# EAGLE design Conectores (EAGLE 6.5.0)

## Sheet 1 of 6
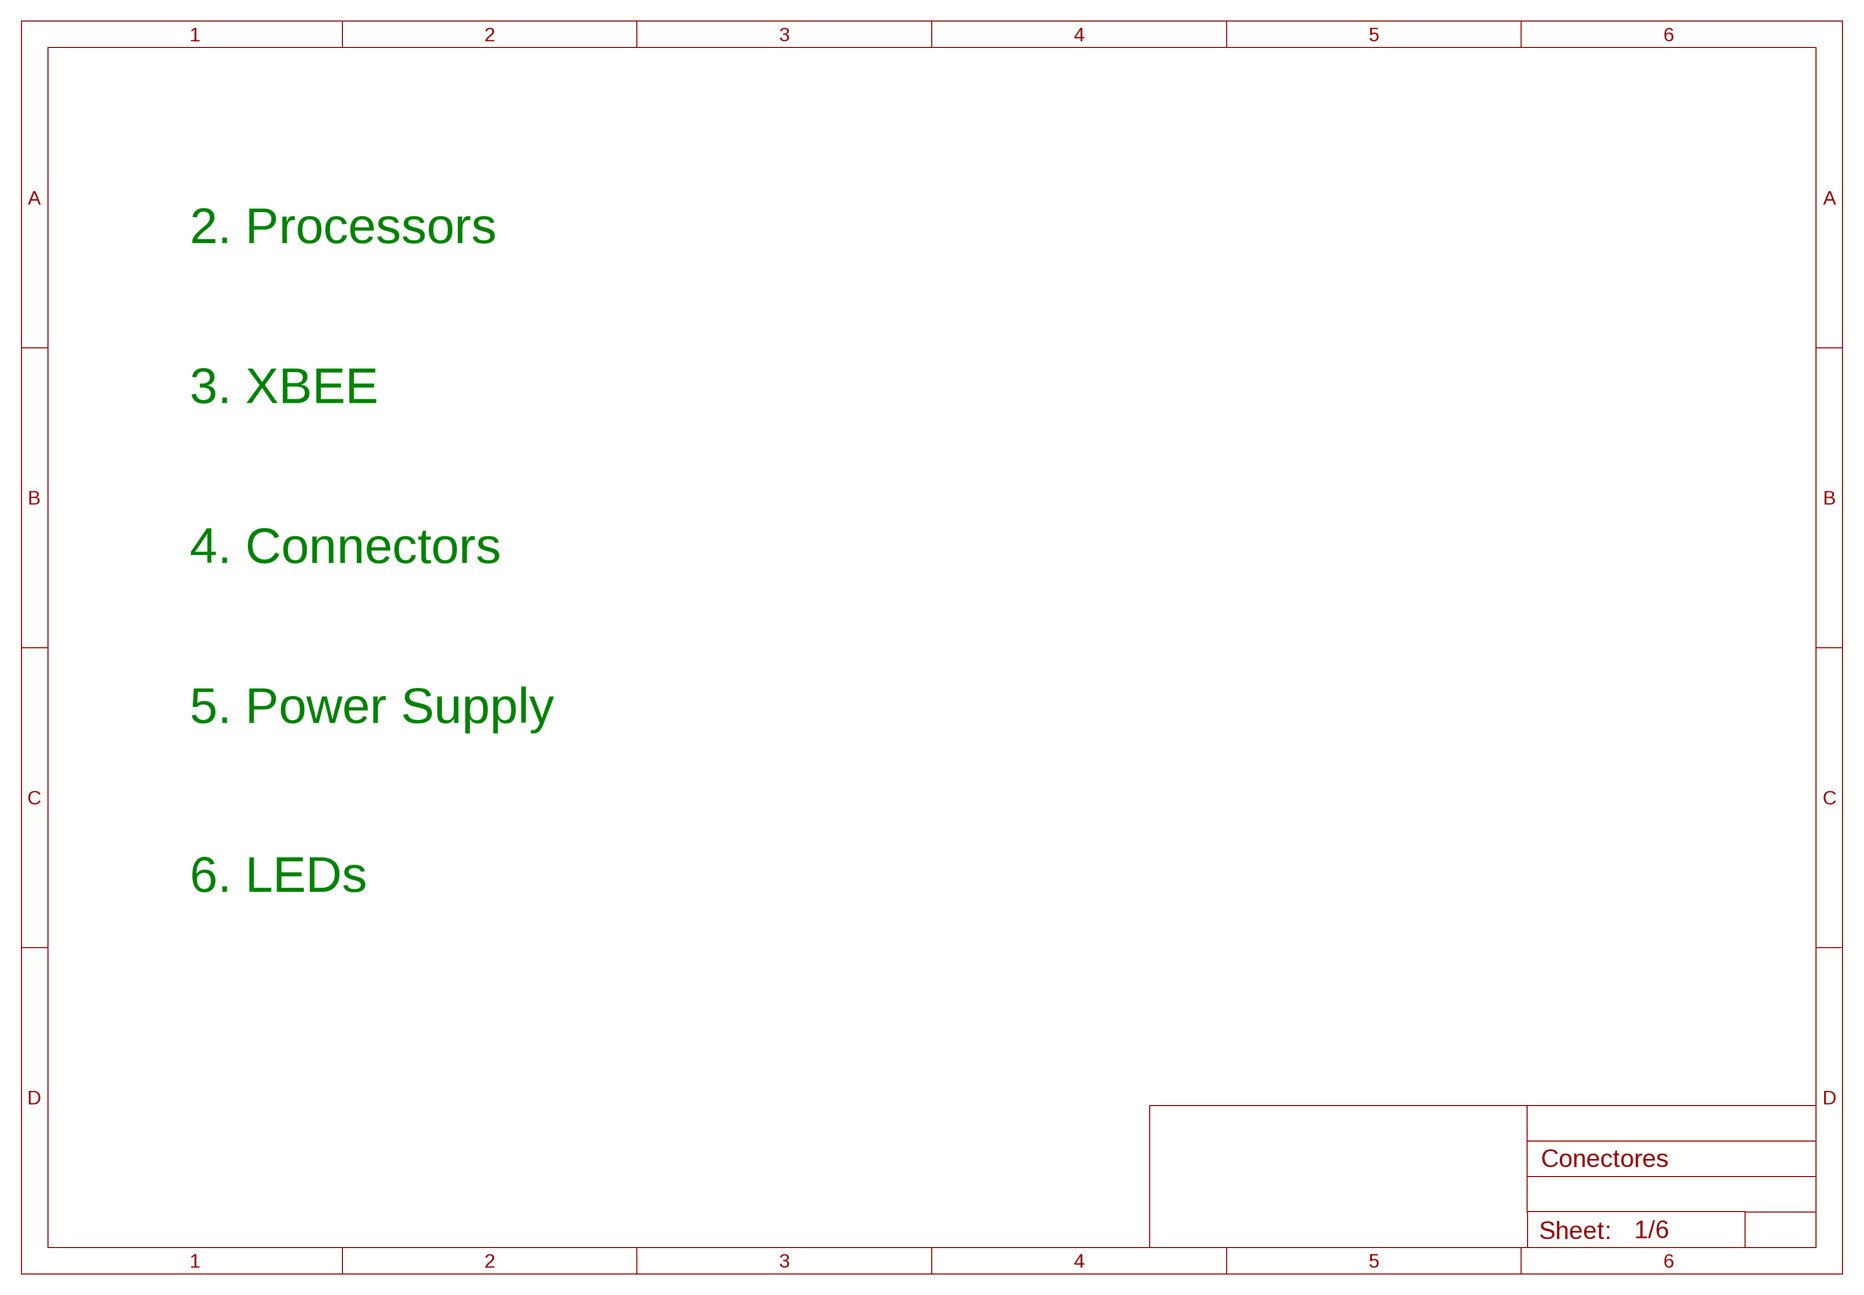
[diagram p0: schematic, sheet 1]

### Notes on the sheet
- 2. Processors
- 3. XBEE
- 4. Connectors
- 5. Power Supply
- 6. LEDs

## Sheet 2 of 6
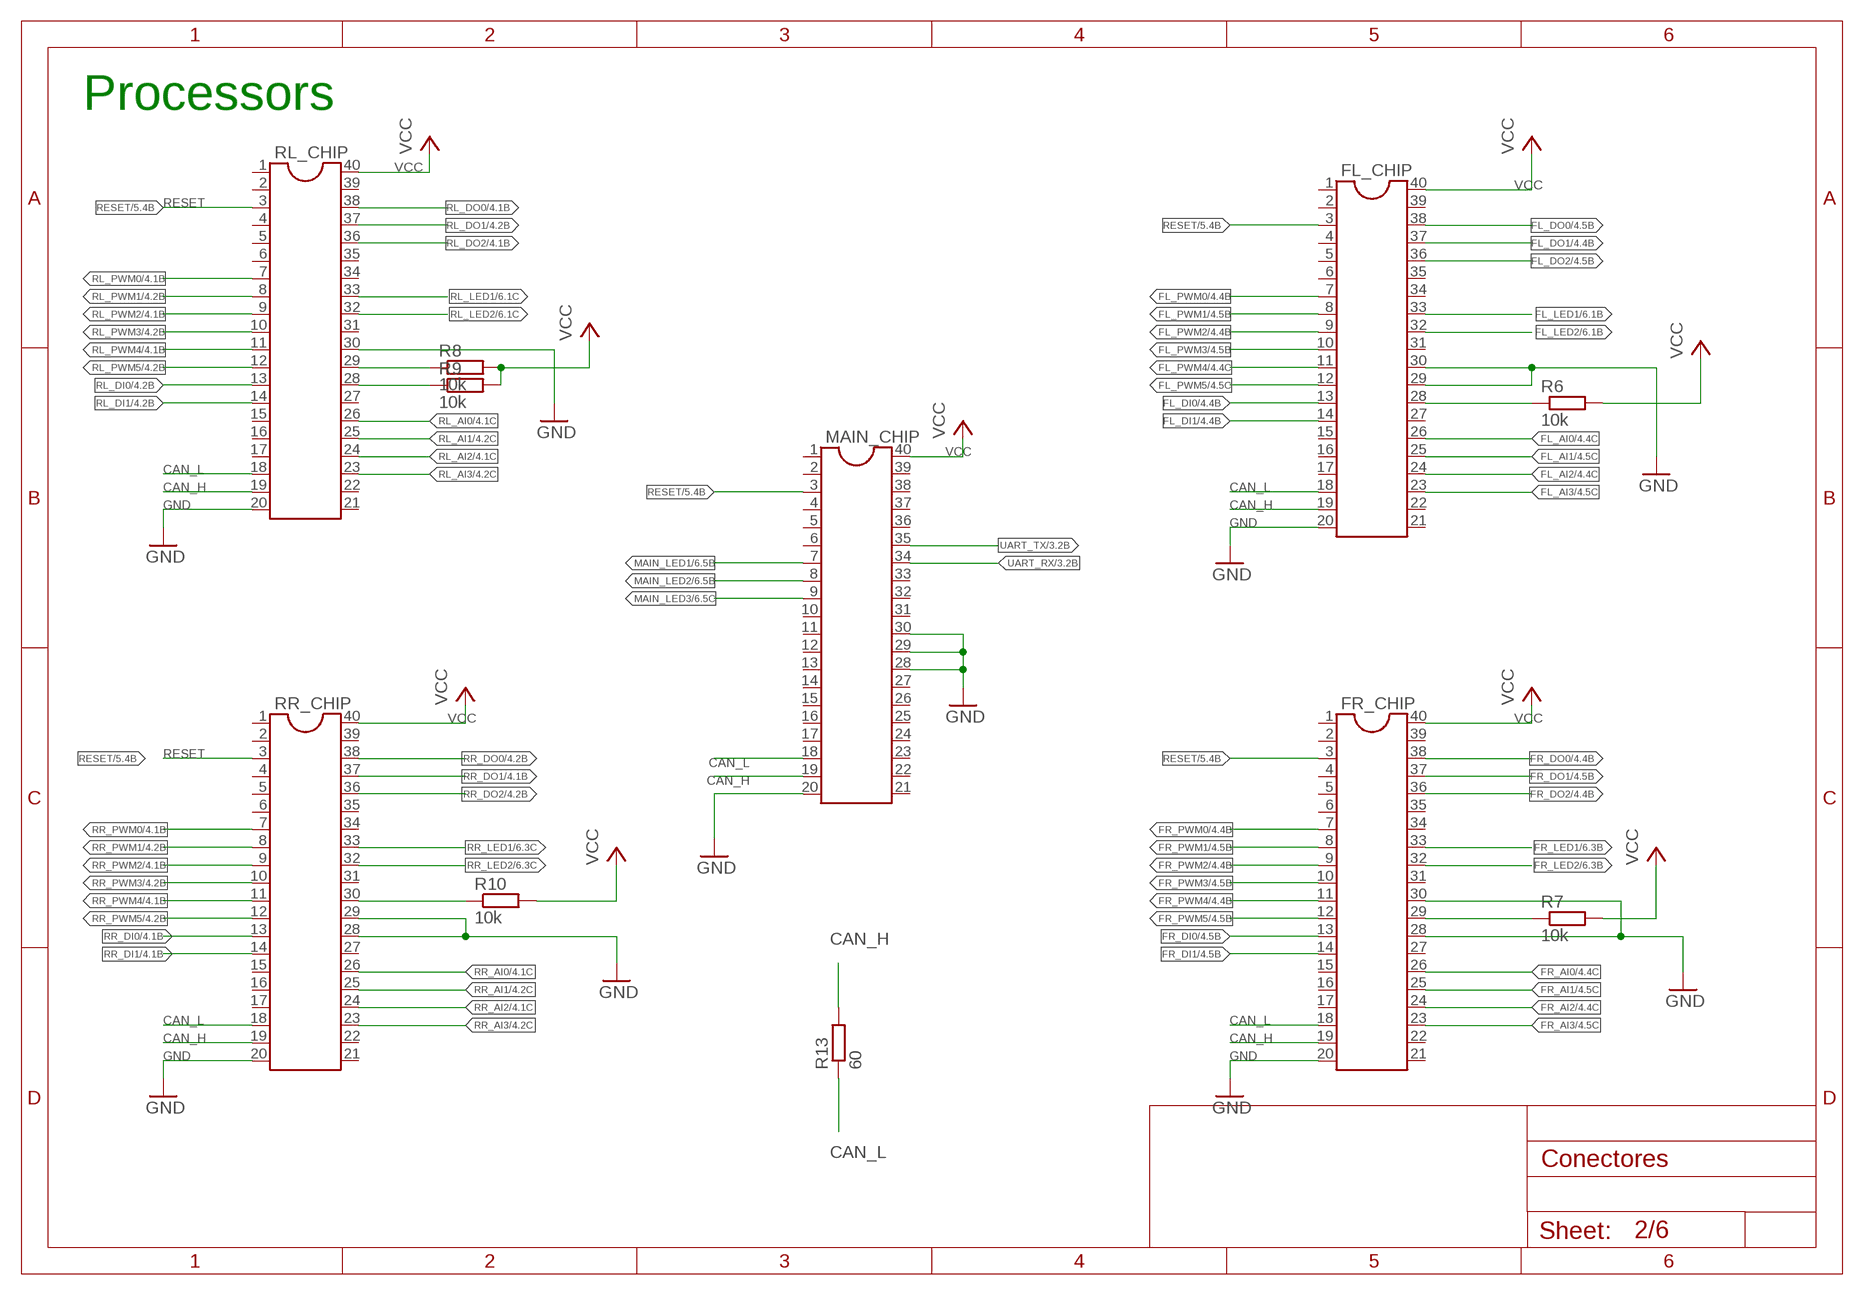
[diagram p1: schematic, sheet 2]

### Parts
FL_CHIP  DIL40  [DIL40]
FR_CHIP  DIL40  [DIL40]
MAIN_CHIP  DIL40  [DIL40]
R6  10k  R-EU_M0805  [M0805]
R7  10k  R-EU_M0805  [M0805]
R8  10k  R-EU_M0805  [M0805]
R9  10k  R-EU_M0805  [M0805]
R10  10k  R-EU_M0805  [M0805]
R13  60  R-EU_R0805  [R0805]
RL_CHIP  DIL40  [DIL40]
RR_CHIP  DIL40  [DIL40]

### Nets
CAN_H: FL_CHIP.19 FR_CHIP.19 MAIN_CHIP.19 R13.2 RL_CHIP.19 RR_CHIP.19 ; also sheet 4
CAN_L: FL_CHIP.18 FR_CHIP.18 MAIN_CHIP.18 R13.1 RL_CHIP.18 RR_CHIP.18 ; also sheet 4
FL_AI0: FL_CHIP.26 ; also sheet 4
FL_AI1: FL_CHIP.25 ; also sheet 4
FL_AI2: FL_CHIP.24 ; also sheet 4
FL_AI3: FL_CHIP.23 ; also sheet 4
FL_DI0: FL_CHIP.13 ; also sheet 4
FL_DI1: FL_CHIP.14 ; also sheet 4
FL_DO0: FL_CHIP.38 ; also sheet 4
FL_DO1: FL_CHIP.37 ; also sheet 4
FL_DO2: FL_CHIP.36 ; also sheet 4
FL_LED1: FL_CHIP.33 ; also sheet 6
FL_LED2: FL_CHIP.32 ; also sheet 6
FL_PWM0: FL_CHIP.7 ; also sheet 4
FL_PWM1: FL_CHIP.8 ; also sheet 4
FL_PWM2: FL_CHIP.9 ; also sheet 4
FL_PWM3: FL_CHIP.10 ; also sheet 4
FL_PWM4: FL_CHIP.11 ; also sheet 4
FL_PWM5: FL_CHIP.12 ; also sheet 4
FR_AI0: FR_CHIP.26 ; also sheet 4
FR_AI1: FR_CHIP.25 ; also sheet 4
FR_AI2: FR_CHIP.24 ; also sheet 4
FR_AI3: FR_CHIP.23 ; also sheet 4
FR_DI0: FR_CHIP.13 ; also sheet 4
FR_DI1: FR_CHIP.14 ; also sheet 4
FR_DIP2: FR_CHIP.29 R7.1
FR_DO0: FR_CHIP.38 ; also sheet 4
FR_DO1: FR_CHIP.37 ; also sheet 4
FR_DO2: FR_CHIP.36 ; also sheet 4
FR_LED1: FR_CHIP.33 ; also sheet 6
FR_LED2: FR_CHIP.32 ; also sheet 6
FR_PWM0: FR_CHIP.7 ; also sheet 4
FR_PWM1: FR_CHIP.8 ; also sheet 4
FR_PWM2: FR_CHIP.9 ; also sheet 4
FR_PWM3: FR_CHIP.10 ; also sheet 4
FR_PWM4: FR_CHIP.11 ; also sheet 4
FR_PWM5: FR_CHIP.12 ; also sheet 4
GND: FL_CHIP.20 FL_CHIP.29 FL_CHIP.30 FR_CHIP.20 FR_CHIP.28 FR_CHIP.30 MAIN_CHIP.20 MAIN_CHIP.28 MAIN_CHIP.29 MAIN_CHIP.30 RL_CHIP.20 RL_CHIP.30 RR_CHIP.20 RR_CHIP.28 RR_CHIP.29 ; also sheet 3,4,5,6
MAIN_LED1: MAIN_CHIP.7 ; also sheet 6
MAIN_LED2: MAIN_CHIP.8 ; also sheet 6
MAIN_LED3: MAIN_CHIP.9 ; also sheet 6
N$3: FL_CHIP.28 R6.1
RESET: FL_CHIP.3 FR_CHIP.3 MAIN_CHIP.3 RL_CHIP.3 RR_CHIP.3 ; also sheet 5
RL_AI0: RL_CHIP.26 ; also sheet 4
RL_AI1: RL_CHIP.25 ; also sheet 4
RL_AI2: RL_CHIP.24 ; also sheet 4
RL_AI3: RL_CHIP.23 ; also sheet 4
RL_DI0: RL_CHIP.13 ; also sheet 4
RL_DI1: RL_CHIP.14 ; also sheet 4
RL_DIP2: R8.1 RL_CHIP.29
RL_DIP3: R9.1 RL_CHIP.28
RL_DO0: RL_CHIP.38 ; also sheet 4
RL_DO1: RL_CHIP.37 ; also sheet 4
RL_DO2: RL_CHIP.36 ; also sheet 4
RL_LED1: RL_CHIP.33 ; also sheet 6
RL_LED2: RL_CHIP.32 ; also sheet 6
RL_PWM0: RL_CHIP.7 ; also sheet 4
RL_PWM1: RL_CHIP.8 ; also sheet 4
RL_PWM2: RL_CHIP.9 ; also sheet 4
RL_PWM3: RL_CHIP.10 ; also sheet 4
RL_PWM4: RL_CHIP.11 ; also sheet 4
RL_PWM5: RL_CHIP.12 ; also sheet 4
RR_AI0: RR_CHIP.26 ; also sheet 4
RR_AI1: RR_CHIP.25 ; also sheet 4
RR_AI2: RR_CHIP.24 ; also sheet 4
RR_AI3: RR_CHIP.23 ; also sheet 4
RR_DI0: RR_CHIP.13 ; also sheet 4
RR_DI1: RR_CHIP.14 ; also sheet 4
RR_DIP1: R10.1 RR_CHIP.30
RR_DO0: RR_CHIP.38 ; also sheet 4
RR_DO1: RR_CHIP.37 ; also sheet 4
RR_DO2: RR_CHIP.36 ; also sheet 4
RR_LED1: RR_CHIP.33 ; also sheet 6
RR_LED2: RR_CHIP.32 ; also sheet 6
RR_PWM0: RR_CHIP.7 ; also sheet 4
RR_PWM1: RR_CHIP.8 ; also sheet 4
RR_PWM2: RR_CHIP.9 ; also sheet 4
RR_PWM3: RR_CHIP.10 ; also sheet 4
RR_PWM4: RR_CHIP.11 ; also sheet 4
RR_PWM5: RR_CHIP.12 ; also sheet 4
UART_RX: MAIN_CHIP.34 ; also sheet 3
UART_TX: MAIN_CHIP.35 ; also sheet 3
VCC: FL_CHIP.40 FR_CHIP.40 MAIN_CHIP.40 R6.2 R7.2 R8.2 R9.2 R10.2 RL_CHIP.40 RR_CHIP.40 ; also sheet 5,6
Unconnected: FL_CHIP.1 FL_CHIP.2 FL_CHIP.4 FL_CHIP.5 FL_CHIP.6 FL_CHIP.15 FL_CHIP.16 FL_CHIP.17 FL_CHIP.21 FL_CHIP.22 FL_CHIP.27 FL_CHIP.31 FL_CHIP.34 FL_CHIP.35 FL_CHIP.39 FR_CHIP.1 FR_CHIP.2 FR_CHIP.4 FR_CHIP.5 FR_CHIP.6 FR_CHIP.15 FR_CHIP.16 FR_CHIP.17 FR_CHIP.21 FR_CHIP.22 FR_CHIP.27 FR_CHIP.31 FR_CHIP.34 FR_CHIP.35 FR_CHIP.39 MAIN_CHIP.1 MAIN_CHIP.2 MAIN_CHIP.4 MAIN_CHIP.5 MAIN_CHIP.6 MAIN_CHIP.10 MAIN_CHIP.11 MAIN_CHIP.12 MAIN_CHIP.13 MAIN_CHIP.14 MAIN_CHIP.15 MAIN_CHIP.16 MAIN_CHIP.17 MAIN_CHIP.21 MAIN_CHIP.22 MAIN_CHIP.23 MAIN_CHIP.24 MAIN_CHIP.25 MAIN_CHIP.26 MAIN_CHIP.27 MAIN_CHIP.31 MAIN_CHIP.32 MAIN_CHIP.33 MAIN_CHIP.36 MAIN_CHIP.37 MAIN_CHIP.38 MAIN_CHIP.39 RL_CHIP.1 RL_CHIP.2 RL_CHIP.4 RL_CHIP.5 RL_CHIP.6 RL_CHIP.15 RL_CHIP.16 RL_CHIP.17 RL_CHIP.21 RL_CHIP.22 RL_CHIP.27 RL_CHIP.31 RL_CHIP.34 RL_CHIP.35 RL_CHIP.39 RR_CHIP.1 RR_CHIP.2 RR_CHIP.4 RR_CHIP.5 RR_CHIP.6 RR_CHIP.15 RR_CHIP.16 RR_CHIP.17 RR_CHIP.21 RR_CHIP.22 RR_CHIP.27 RR_CHIP.31 RR_CHIP.34 RR_CHIP.35 RR_CHIP.39

### Notes on the sheet
- Processors

## Sheet 3 of 6
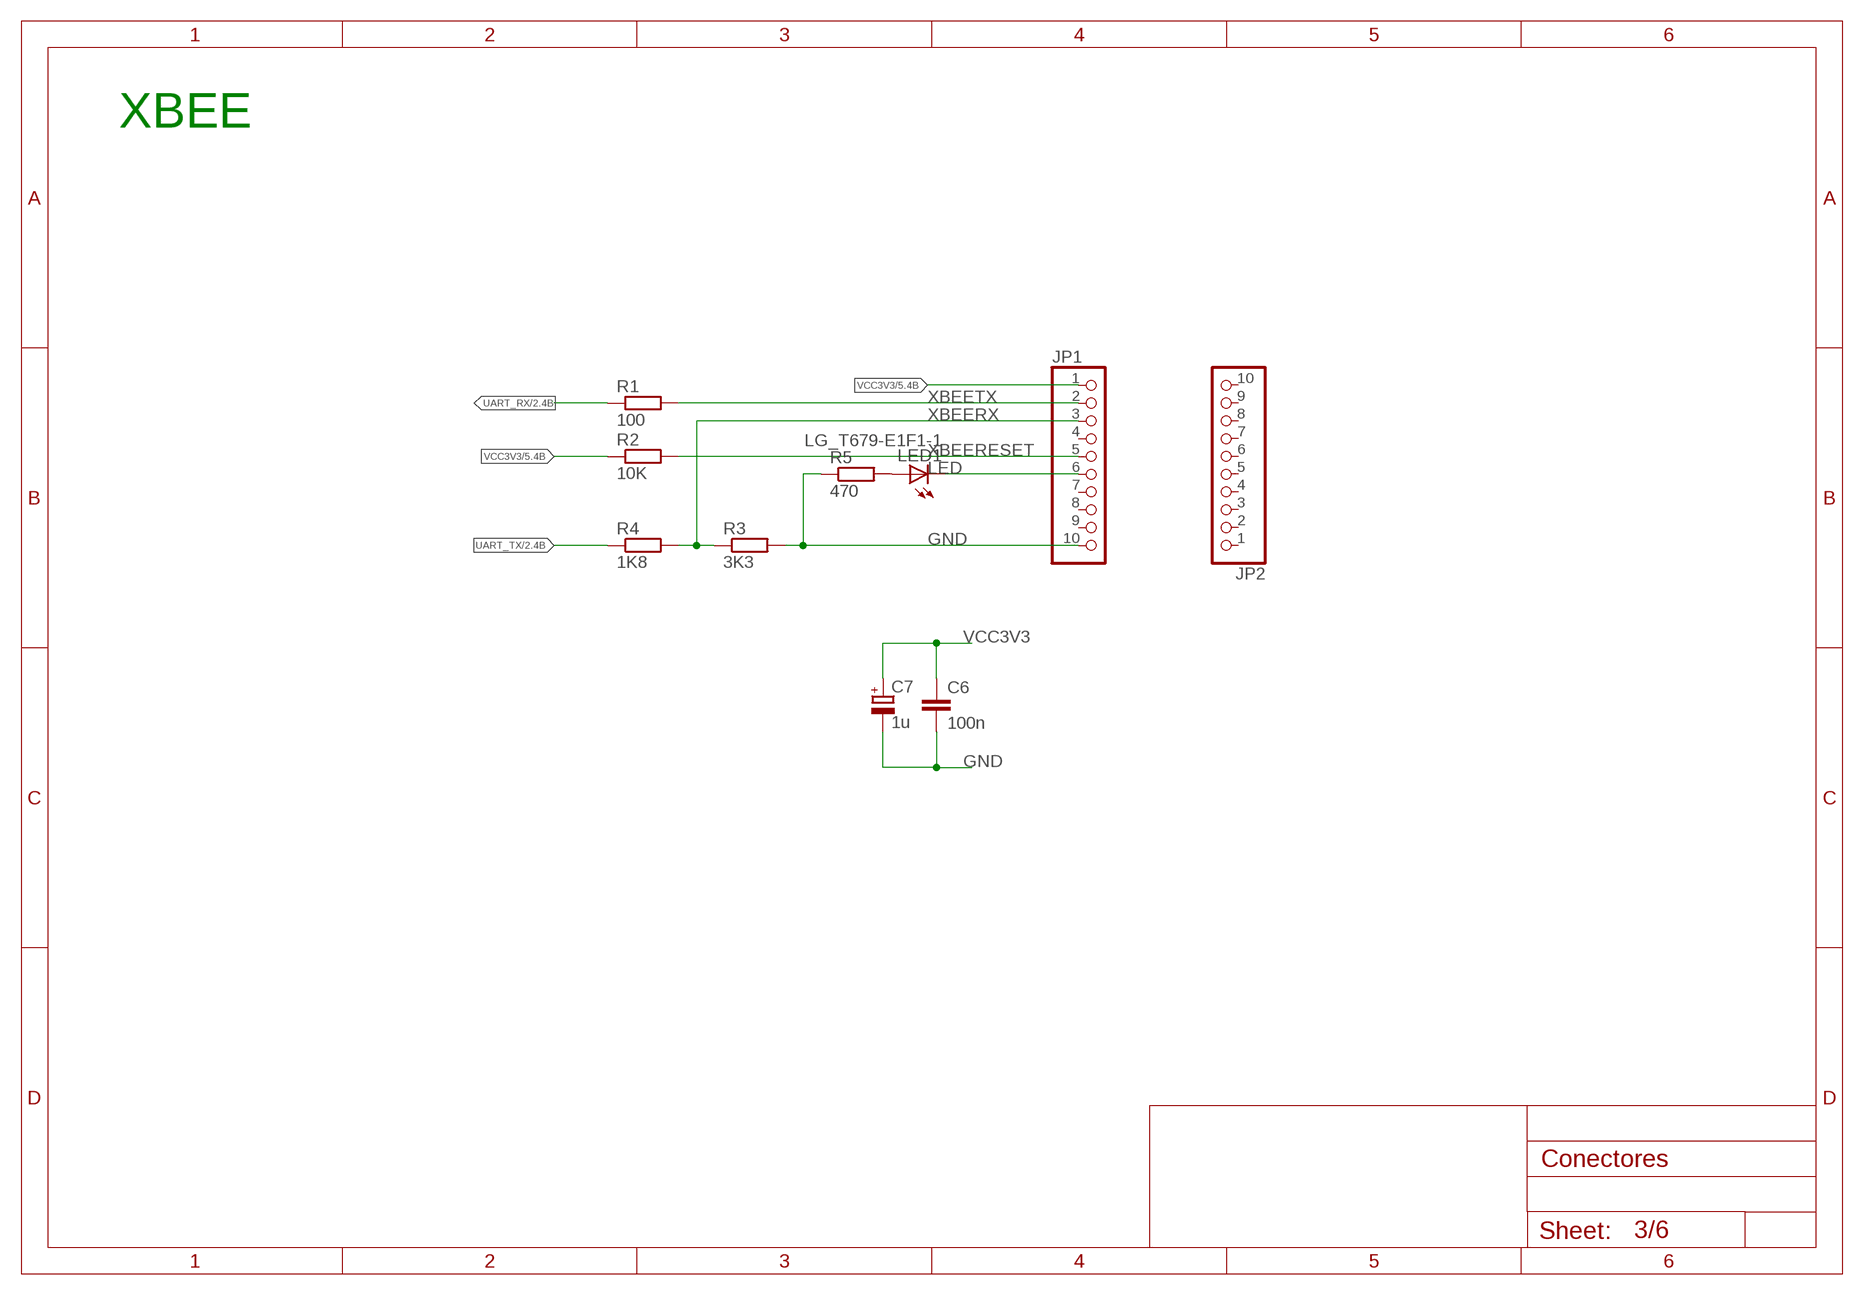
[diagram p2: schematic, sheet 3]

### Parts
C6  100n  C-EUC0805  [C0805]
C7  1u  CPOL-EUCT3528  [CT3528]
JP1  PINHD-1X10_2.00  [1X10M]
JP2  PINHD-1X10_2.00  [1X10M]
LED1  LG_T679-E1F1-1  [PLCC2]
R1  100  R-EU_M0805  [M0805]
R2  10K  R-EU_M0805  [M0805]
R3  3K3  R-EU_M0805  [M0805]
R4  1K8  R-EU_M0805  [M0805]
R5  470  R-EU_M0805  [M0805]

### Nets
GND: C6.2 C7.- JP1.10 R3.2 R5.1 ; also sheet 2,4,5,6
LED: JP1.6 LED1.C
N$1: LED1.A R5.2
UART_RX: R1.1 ; also sheet 2
UART_TX: R4.1 ; also sheet 2
VCC3V3: C6.1 C7.+ JP1.1 R2.1 ; also sheet 5
XBEERESET: JP1.5 R2.2
XBEERX: JP1.3 R3.1 R4.2
XBEETX: JP1.2 R1.2
Unconnected: JP1.4 JP1.7 JP1.8 JP1.9 JP2.1 JP2.2 JP2.3 JP2.4 JP2.5 JP2.6 JP2.7 JP2.8 JP2.9 JP2.10

### Notes on the sheet
- XBEE

## Sheet 4 of 6
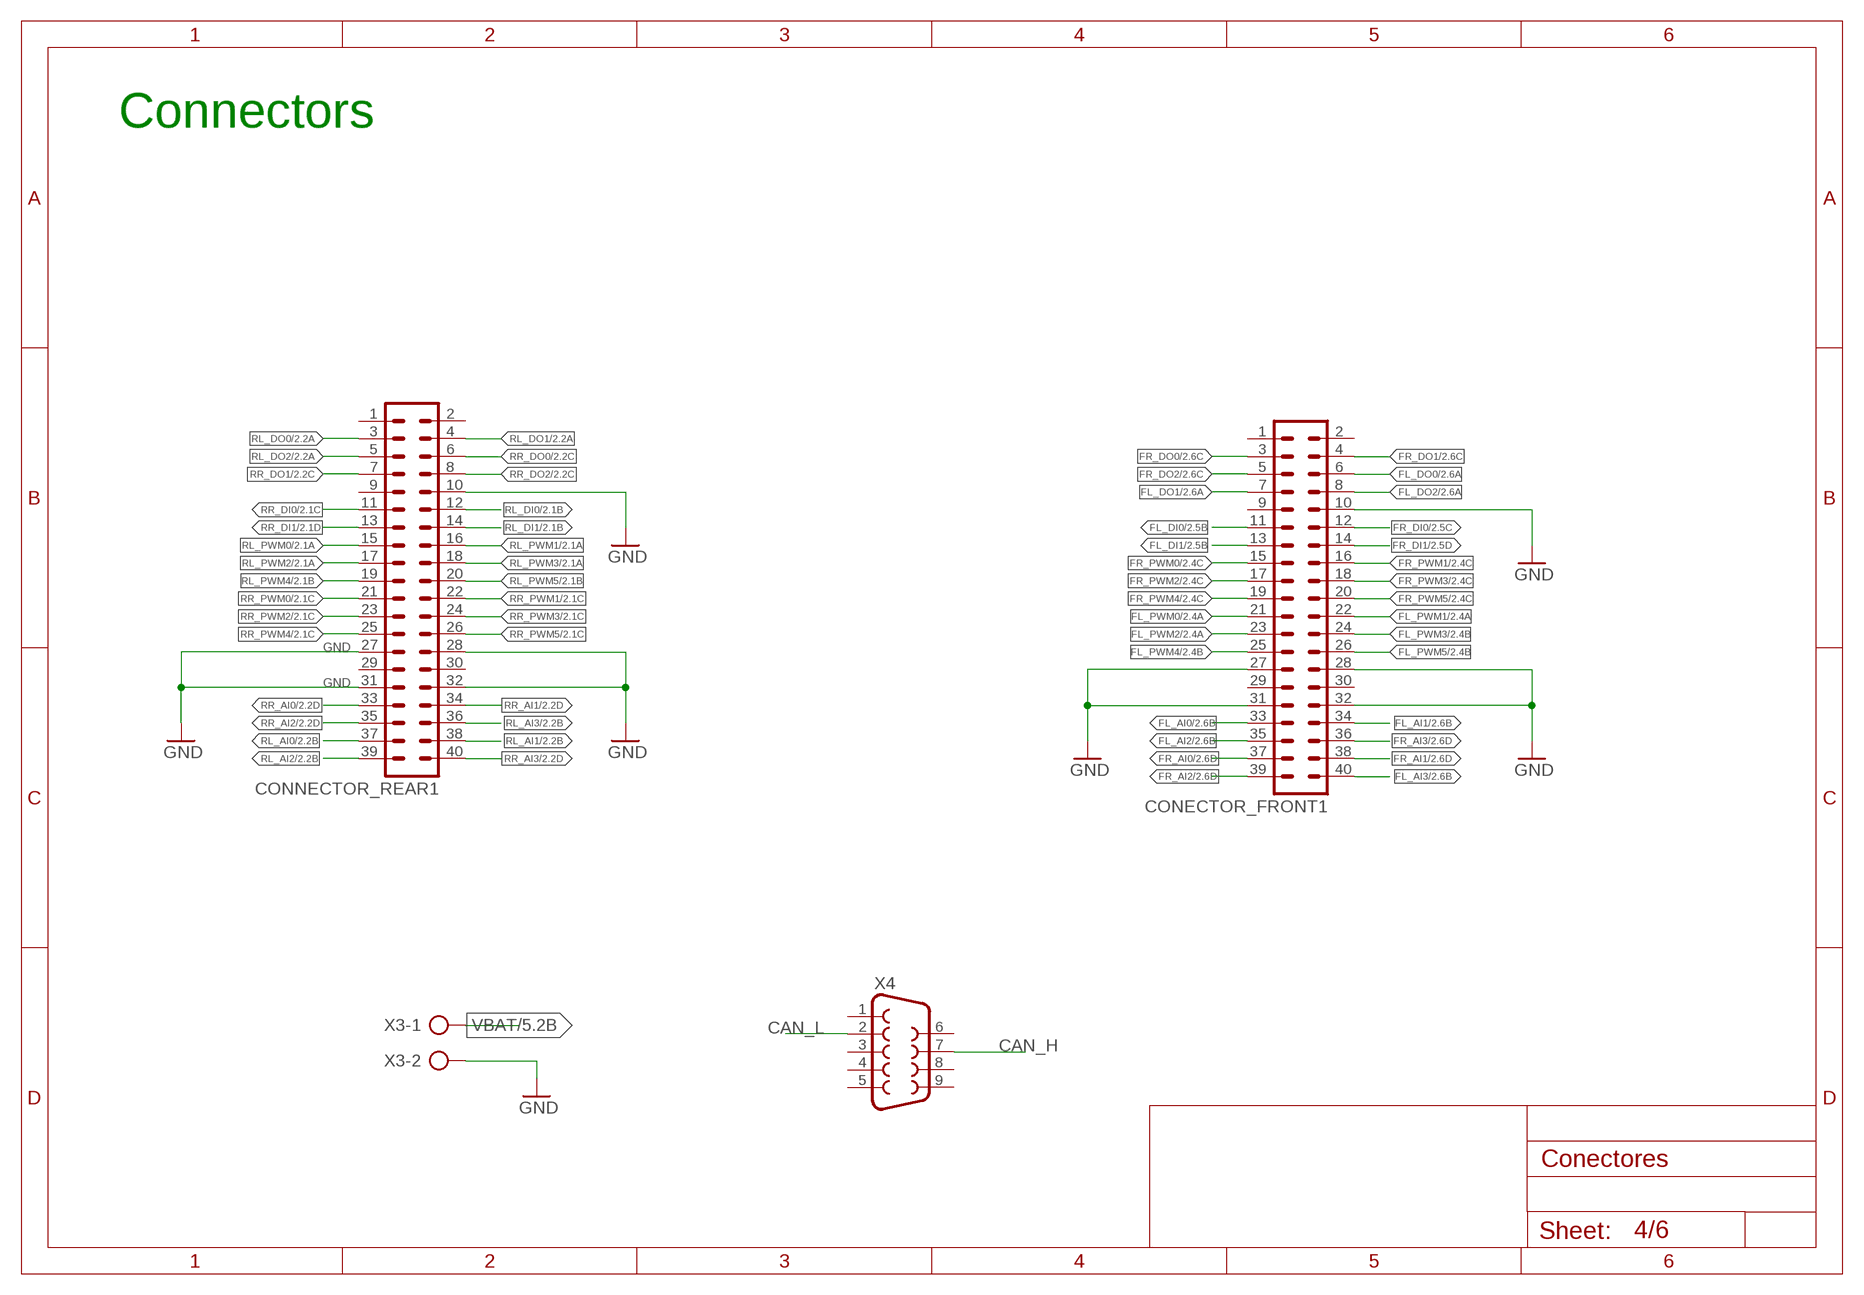
[diagram p3: schematic, sheet 4]

### Parts
CONECTOR_FRONT1  ML40  [ML40]
CONNECTOR_REAR1  ML40  [ML40]
X3  AK300/2  [AK300/2]
X4  F09HP  [F09HP]

### Nets
CAN_H: X4.7 ; also sheet 2
CAN_L: X4.2 ; also sheet 2
FL_AI0: CONECTOR_FRONT1.33 ; also sheet 2
FL_AI1: CONECTOR_FRONT1.34 ; also sheet 2
FL_AI2: CONECTOR_FRONT1.35 ; also sheet 2
FL_AI3: CONECTOR_FRONT1.40 ; also sheet 2
FL_DI0: CONECTOR_FRONT1.11 ; also sheet 2
FL_DI1: CONECTOR_FRONT1.13 ; also sheet 2
FL_DO0: CONECTOR_FRONT1.6 ; also sheet 2
FL_DO1: CONECTOR_FRONT1.7 ; also sheet 2
FL_DO2: CONECTOR_FRONT1.8 ; also sheet 2
FL_PWM0: CONECTOR_FRONT1.21 ; also sheet 2
FL_PWM1: CONECTOR_FRONT1.22 ; also sheet 2
FL_PWM2: CONECTOR_FRONT1.23 ; also sheet 2
FL_PWM3: CONECTOR_FRONT1.24 ; also sheet 2
FL_PWM4: CONECTOR_FRONT1.25 ; also sheet 2
FL_PWM5: CONECTOR_FRONT1.26 ; also sheet 2
FR_AI0: CONECTOR_FRONT1.37 ; also sheet 2
FR_AI1: CONECTOR_FRONT1.38 ; also sheet 2
FR_AI2: CONECTOR_FRONT1.39 ; also sheet 2
FR_AI3: CONECTOR_FRONT1.36 ; also sheet 2
FR_DI0: CONECTOR_FRONT1.12 ; also sheet 2
FR_DI1: CONECTOR_FRONT1.14 ; also sheet 2
FR_DO0: CONECTOR_FRONT1.3 ; also sheet 2
FR_DO1: CONECTOR_FRONT1.4 ; also sheet 2
FR_DO2: CONECTOR_FRONT1.5 ; also sheet 2
FR_PWM0: CONECTOR_FRONT1.15 ; also sheet 2
FR_PWM1: CONECTOR_FRONT1.16 ; also sheet 2
FR_PWM2: CONECTOR_FRONT1.17 ; also sheet 2
FR_PWM3: CONECTOR_FRONT1.18 ; also sheet 2
FR_PWM4: CONECTOR_FRONT1.19 ; also sheet 2
FR_PWM5: CONECTOR_FRONT1.20 ; also sheet 2
GND: CONECTOR_FRONT1.10 CONECTOR_FRONT1.27 CONECTOR_FRONT1.28 CONECTOR_FRONT1.31 CONECTOR_FRONT1.32 CONNECTOR_REAR1.10 CONNECTOR_REAR1.27 CONNECTOR_REAR1.28 CONNECTOR_REAR1.31 CONNECTOR_REAR1.32 X3.2 ; also sheet 2,3,5,6
RL_AI0: CONNECTOR_REAR1.37 ; also sheet 2
RL_AI1: CONNECTOR_REAR1.38 ; also sheet 2
RL_AI2: CONNECTOR_REAR1.39 ; also sheet 2
RL_AI3: CONNECTOR_REAR1.36 ; also sheet 2
RL_DI0: CONNECTOR_REAR1.12 ; also sheet 2
RL_DI1: CONNECTOR_REAR1.14 ; also sheet 2
RL_DO0: CONNECTOR_REAR1.3 ; also sheet 2
RL_DO1: CONNECTOR_REAR1.4 ; also sheet 2
RL_DO2: CONNECTOR_REAR1.5 ; also sheet 2
RL_PWM0: CONNECTOR_REAR1.15 ; also sheet 2
RL_PWM1: CONNECTOR_REAR1.16 ; also sheet 2
RL_PWM2: CONNECTOR_REAR1.17 ; also sheet 2
RL_PWM3: CONNECTOR_REAR1.18 ; also sheet 2
RL_PWM4: CONNECTOR_REAR1.19 ; also sheet 2
RL_PWM5: CONNECTOR_REAR1.20 ; also sheet 2
RR_AI0: CONNECTOR_REAR1.33 ; also sheet 2
RR_AI1: CONNECTOR_REAR1.34 ; also sheet 2
RR_AI2: CONNECTOR_REAR1.35 ; also sheet 2
RR_AI3: CONNECTOR_REAR1.40 ; also sheet 2
RR_DI0: CONNECTOR_REAR1.11 ; also sheet 2
RR_DI1: CONNECTOR_REAR1.13 ; also sheet 2
RR_DO0: CONNECTOR_REAR1.6 ; also sheet 2
RR_DO1: CONNECTOR_REAR1.7 ; also sheet 2
RR_DO2: CONNECTOR_REAR1.8 ; also sheet 2
RR_PWM0: CONNECTOR_REAR1.21 ; also sheet 2
RR_PWM1: CONNECTOR_REAR1.22 ; also sheet 2
RR_PWM2: CONNECTOR_REAR1.23 ; also sheet 2
RR_PWM3: CONNECTOR_REAR1.24 ; also sheet 2
RR_PWM4: CONNECTOR_REAR1.25 ; also sheet 2
RR_PWM5: CONNECTOR_REAR1.26 ; also sheet 2
VBAT: X3.1 ; also sheet 5
Unconnected: CONECTOR_FRONT1.1 CONECTOR_FRONT1.2 CONECTOR_FRONT1.9 CONECTOR_FRONT1.29 CONECTOR_FRONT1.30 CONNECTOR_REAR1.1 CONNECTOR_REAR1.2 CONNECTOR_REAR1.9 CONNECTOR_REAR1.29 CONNECTOR_REAR1.30 X4.1 X4.3 X4.4 X4.5 X4.6 X4.8 X4.9

### Notes on the sheet
- Connectors

## Sheet 5 of 6
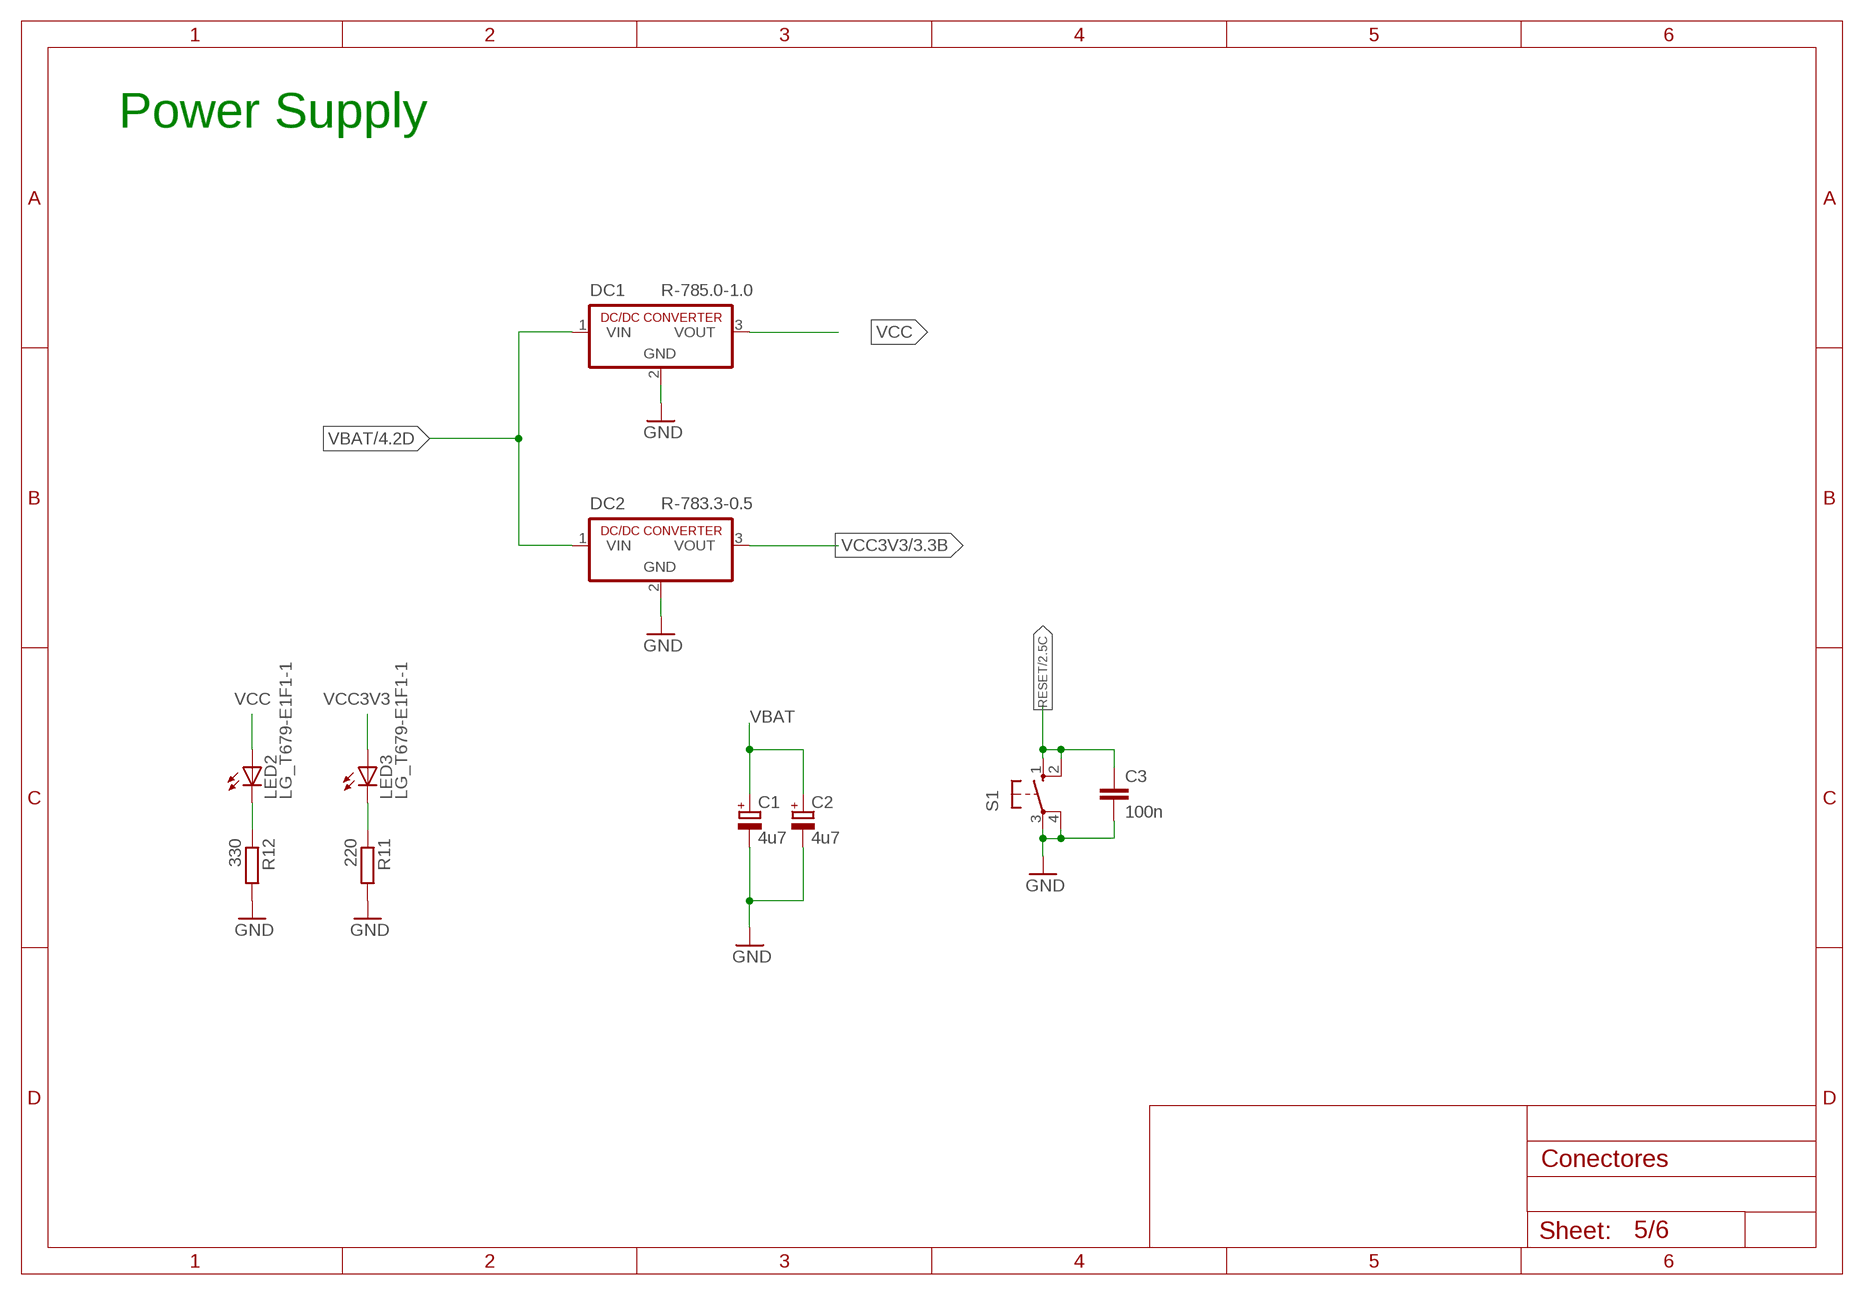
[diagram p4: schematic, sheet 5]

### Parts
C1  4u7  CPOL-EUSMCE  [SMC_E]
C2  4u7  CPOL-EUSMCE  [SMC_E]
C3  100n  C-EUC0805K  [C0805K]
DC1  R-785.0-1.0  R-78C5.0-1.0  [SIP3]
DC2  R-783.3-0.5  R-78C5.0-1.0  [SIP3]
LED2  LG_T679-E1F1-1  [PLCC2]
LED3  LG_T679-E1F1-1  [PLCC2]
R11  220  R-EU_R0805  [R0805]
R12  330  R-EU_R0805  [R0805]
S1  10-XX  [B3F-10XX]

### Nets
GND: C1.- C2.- C3.2 DC1.2(GND) DC2.2(GND) R11.2 R12.2 S1.3(P) S1.4(P1) ; also sheet 2,3,4,6
N$2: LED3.C R11.1
N$4: LED2.C R12.1
RESET: C3.1 S1.1(S) S1.2(S1) ; also sheet 2
VBAT: C1.+ C2.+ DC1.1(VIN) DC2.1(VIN) ; also sheet 4
VCC: DC1.3(VOUT) LED2.A ; also sheet 2,6
VCC3V3: DC2.3(VOUT) LED3.A ; also sheet 3

### Notes on the sheet
- Power Supply

## Sheet 6 of 6
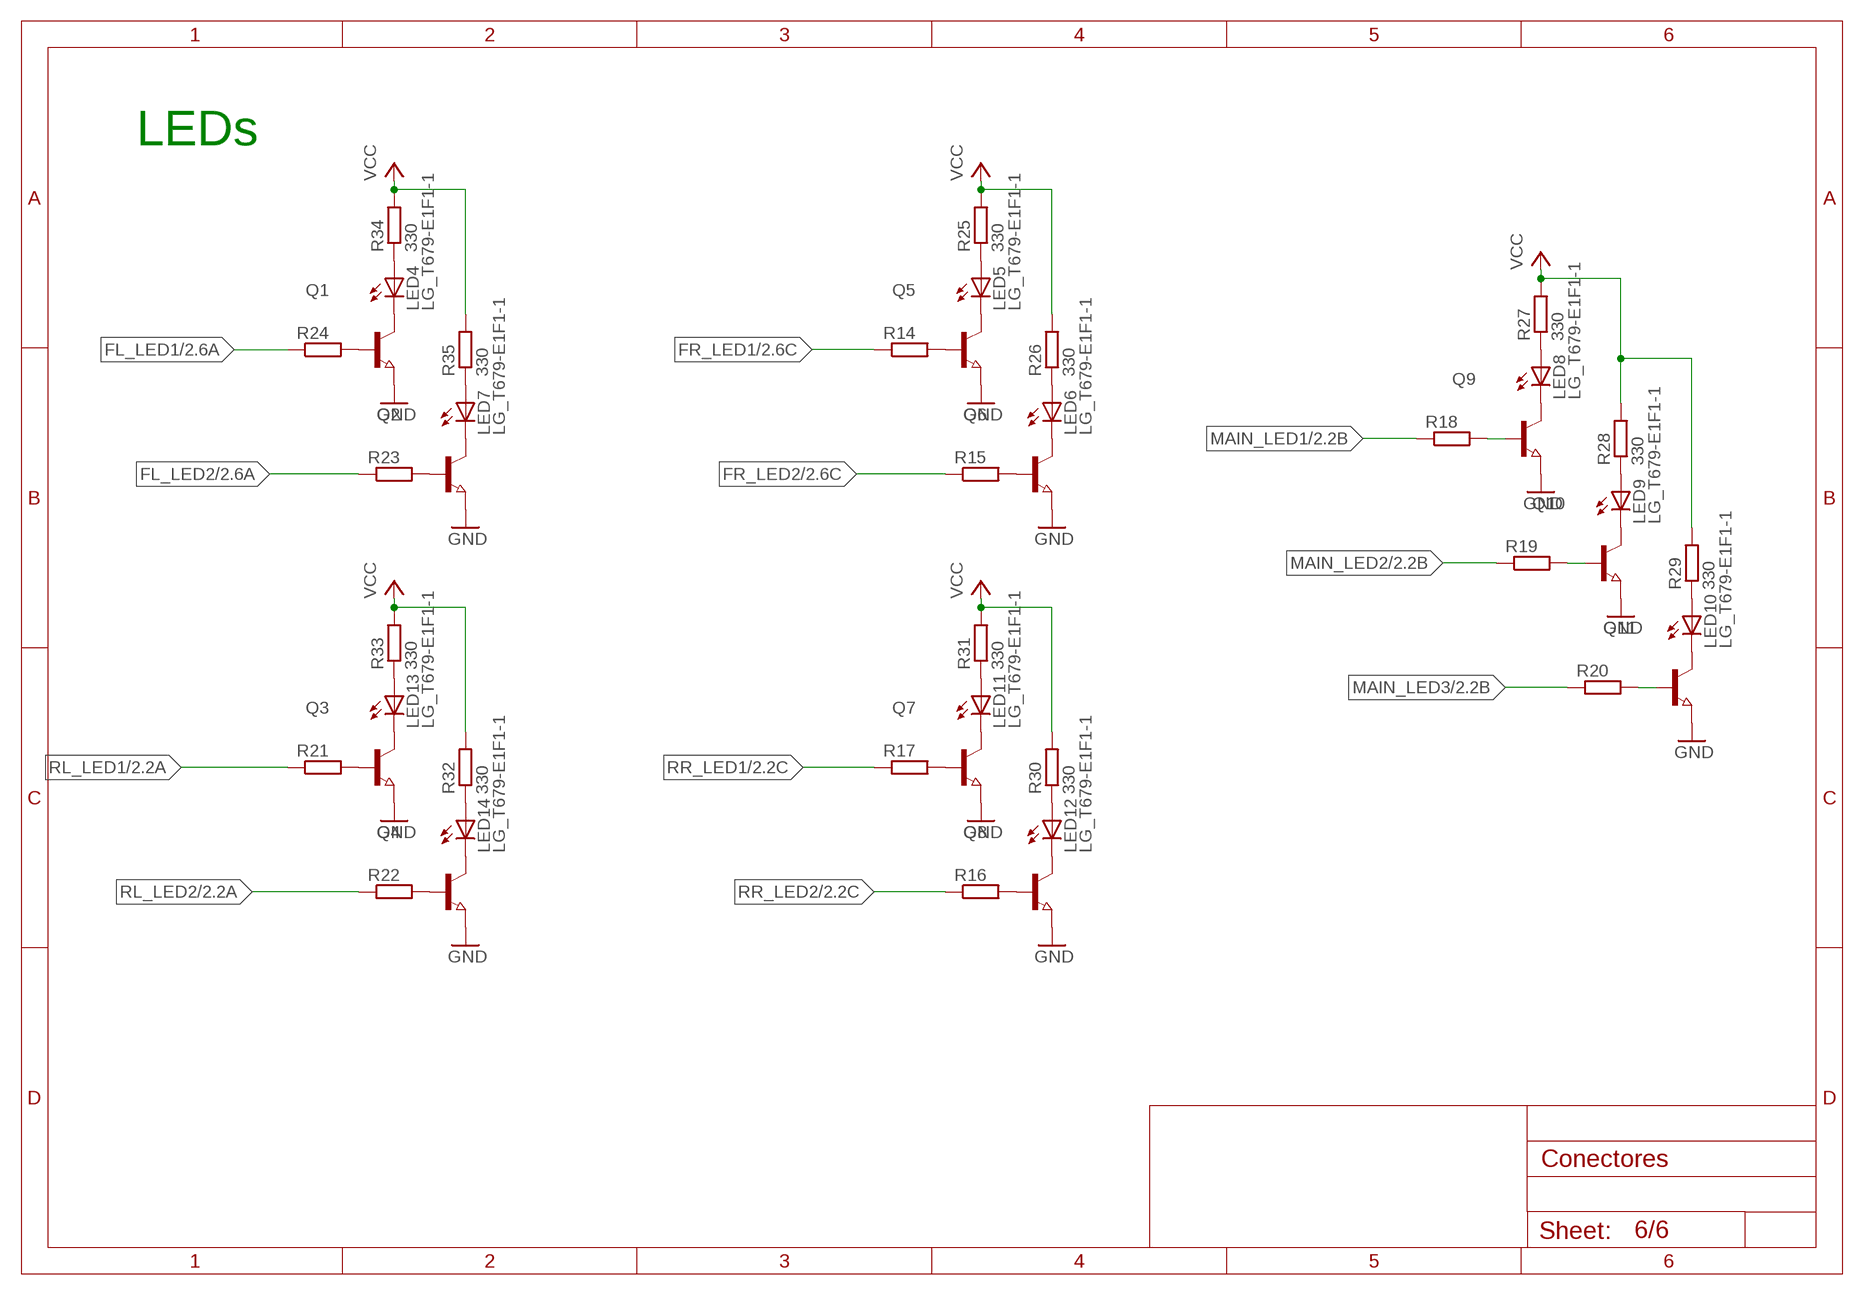
[diagram p5: schematic, sheet 6]

### Parts
LED4  LG_T679-E1F1-1  [PLCC2]
LED5  LG_T679-E1F1-1  [PLCC2]
LED6  LG_T679-E1F1-1  [PLCC2]
LED7  LG_T679-E1F1-1  [PLCC2]
LED8  LG_T679-E1F1-1  [PLCC2]
LED9  LG_T679-E1F1-1  [PLCC2]
LED10  LG_T679-E1F1-1  [PLCC2]
LED11  LG_T679-E1F1-1  [PLCC2]
LED12  LG_T679-E1F1-1  [PLCC2]
LED13  LG_T679-E1F1-1  [PLCC2]
LED14  LG_T679-E1F1-1  [PLCC2]
Q1  NPN-TRANSISTOR_SOT23  [SOT23]
Q2  NPN-TRANSISTOR_SOT23  [SOT23]
Q3  NPN-TRANSISTOR_SOT23  [SOT23]
Q4  NPN-TRANSISTOR_SOT23  [SOT23]
Q5  NPN-TRANSISTOR_SOT23  [SOT23]
Q6  NPN-TRANSISTOR_SOT23  [SOT23]
Q7  NPN-TRANSISTOR_SOT23  [SOT23]
Q8  NPN-TRANSISTOR_SOT23  [SOT23]
Q9  NPN-TRANSISTOR_SOT23  [SOT23]
Q10  NPN-TRANSISTOR_SOT23  [SOT23]
Q11  NPN-TRANSISTOR_SOT23  [SOT23]
R14  R-EU_R0805  [R0805]
R15  R-EU_R0805  [R0805]
R16  R-EU_R0805  [R0805]
R17  R-EU_R0805  [R0805]
R18  R-EU_R0805  [R0805]
R19  R-EU_R0805  [R0805]
R20  R-EU_R0805  [R0805]
R21  R-EU_R0805  [R0805]
R22  R-EU_R0805  [R0805]
R23  R-EU_R0805  [R0805]
R24  R-EU_R0805  [R0805]
R25  330  R-EU_R0805  [R0805]
R26  330  R-EU_R0805  [R0805]
R27  330  R-EU_R0805  [R0805]
R28  330  R-EU_R0805  [R0805]
R29  330  R-EU_R0805  [R0805]
R30  330  R-EU_R0805  [R0805]
R31  330  R-EU_R0805  [R0805]
R32  330  R-EU_R0805  [R0805]
R33  330  R-EU_R0805  [R0805]
R34  330  R-EU_R0805  [R0805]
R35  330  R-EU_R0805  [R0805]

### Nets
FL_LED1: R24.1 ; also sheet 2
FL_LED2: R23.1 ; also sheet 2
FR_LED1: R14.1 ; also sheet 2
FR_LED2: R15.1 ; also sheet 2
GND: Q1.2(E) Q2.2(E) Q3.2(E) Q4.2(E) Q5.2(E) Q6.2(E) Q7.2(E) Q8.2(E) Q9.2(E) Q10.2(E) Q11.2(E) ; also sheet 2,3,4,5
MAIN_LED1: R18.1 ; also sheet 2
MAIN_LED2: R19.1 ; also sheet 2
MAIN_LED3: R20.1 ; also sheet 2
N$5: Q5.1(B) R14.2
N$6: Q6.1(B) R15.2
N$7: Q8.1(B) R16.2
N$8: Q7.1(B) R17.2
N$9: Q3.1(B) R21.2
N$10: Q4.1(B) R22.2
N$11: Q1.1(B) R24.2
N$12: Q2.1(B) R23.2
N$13: LED4.C Q1.3(C)
N$14: LED5.C Q5.3(C)
N$15: LED8.C Q9.3(C)
N$16: LED10.C Q11.3(C)
N$17: LED11.C Q7.3(C)
N$18: LED13.C Q3.3(C)
N$19: LED7.C Q2.3(C)
N$20: LED14.C Q4.3(C)
N$21: LED6.C Q6.3(C)
N$22: LED12.C Q8.3(C)
N$23: LED9.C Q10.3(C)
N$24: LED5.A R25.1
N$25: LED6.A R26.1
N$26: LED8.A R27.1
N$27: LED9.A R28.1
N$28: LED10.A R29.1
N$29: LED12.A R30.1
N$30: LED11.A R31.1
N$31: LED14.A R32.1
N$32: LED13.A R33.1
N$33: LED4.A R34.1
N$34: LED7.A R35.1
N$35: Q9.1(B) R18.2
N$36: Q10.1(B) R19.2
N$38: Q11.1(B) R20.2
RL_LED1: R21.1 ; also sheet 2
RL_LED2: R22.1 ; also sheet 2
RR_LED1: R17.1 ; also sheet 2
RR_LED2: R16.1 ; also sheet 2
VCC: R25.2 R26.2 R27.2 R28.2 R29.2 R30.2 R31.2 R32.2 R33.2 R34.2 R35.2 ; also sheet 2,5

### Notes on the sheet
- LEDs

## Library data of the parts
C1 C2 C7 = rcl:CPOL-EU: POLARIZED CAPACITOR, European symbol
C3 C6 = rcl:C-EU: CAPACITOR, European symbol
CONECTOR_FRONT1 CONNECTOR_REAR1 = con-ml:ML40: HARTING; OC_FARNELL: unknown; OC_NEWARK: unknown
DC1 DC2 = dc-dc-converter:R-78C*-1.0: INNOLINE DC/DC-Converter 1.0 AMP SIP3 Single Output Source: Data sheet <http://www.mikrocontroller.net/attachment/150645/157764-da-01-en-DC_DC_WANDLER_R_78C5_0_1_0.pdf>
FL_CHIP FR_CHIP MAIN_CHIP RL_CHIP RR_CHIP = ic-package:DIL40: Dual In Line
JP1 JP2 = pinhead-2:PINHD-1X10: PIN HEADER
LED1-LED14 = led:*_T679-?-1: LC TOPLED® Low Current LED Source: http://catalog.osram-os.com .. LG_LS_LY_T679_OBS.pdf; COLOR: green
Q1-Q11 = semicon-smd-ipc:NPN-TRANSISTOR_: NPN TRANSISTOR
R1-R5 = resistor:R-EU_: RESISTOR, European symbol
R6-R35 = rcl:R-EU_: RESISTOR, European symbol
S1 = switch-omron:10-XX: OMRON SWITCH; MPN: B3F-1000; OC_FARNELL: 176432; OC_NEWARK: 36M3542
X3 = con-ptr500:AK300/2: CONNECTOR; OC_FARNELL: unknown; OC_NEWARK: unknown
X4 = con-subd:F09: SUB-D; OC_FARNELL: unknown; OC_NEWARK: unknown

## Board
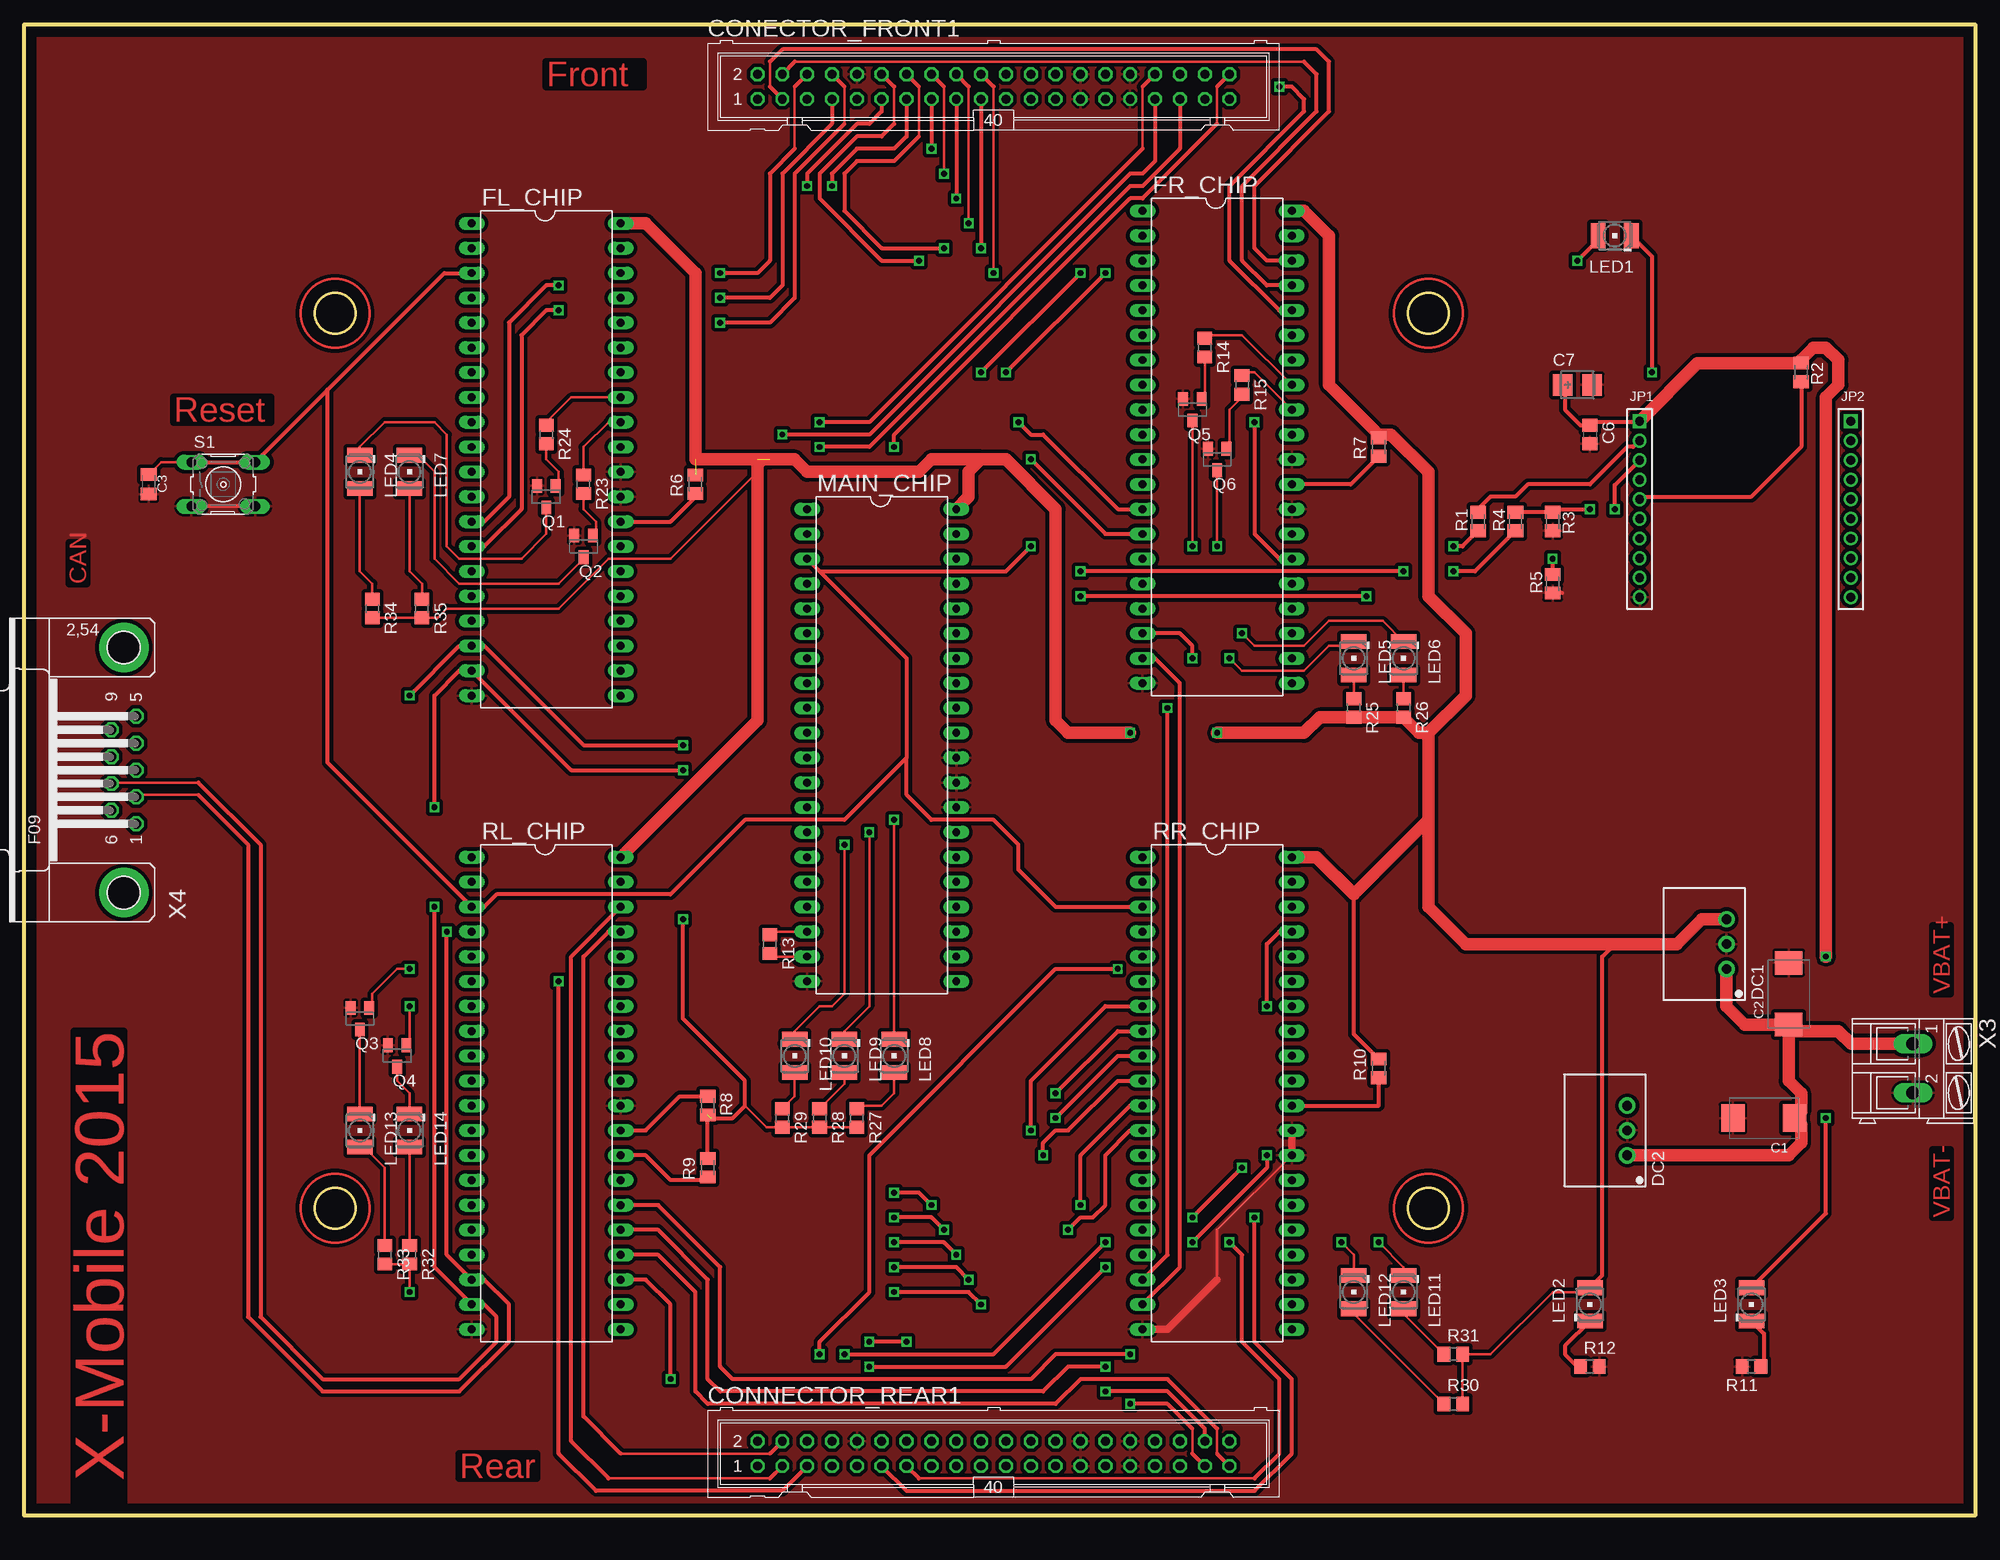
[diagram p6: board, top side]
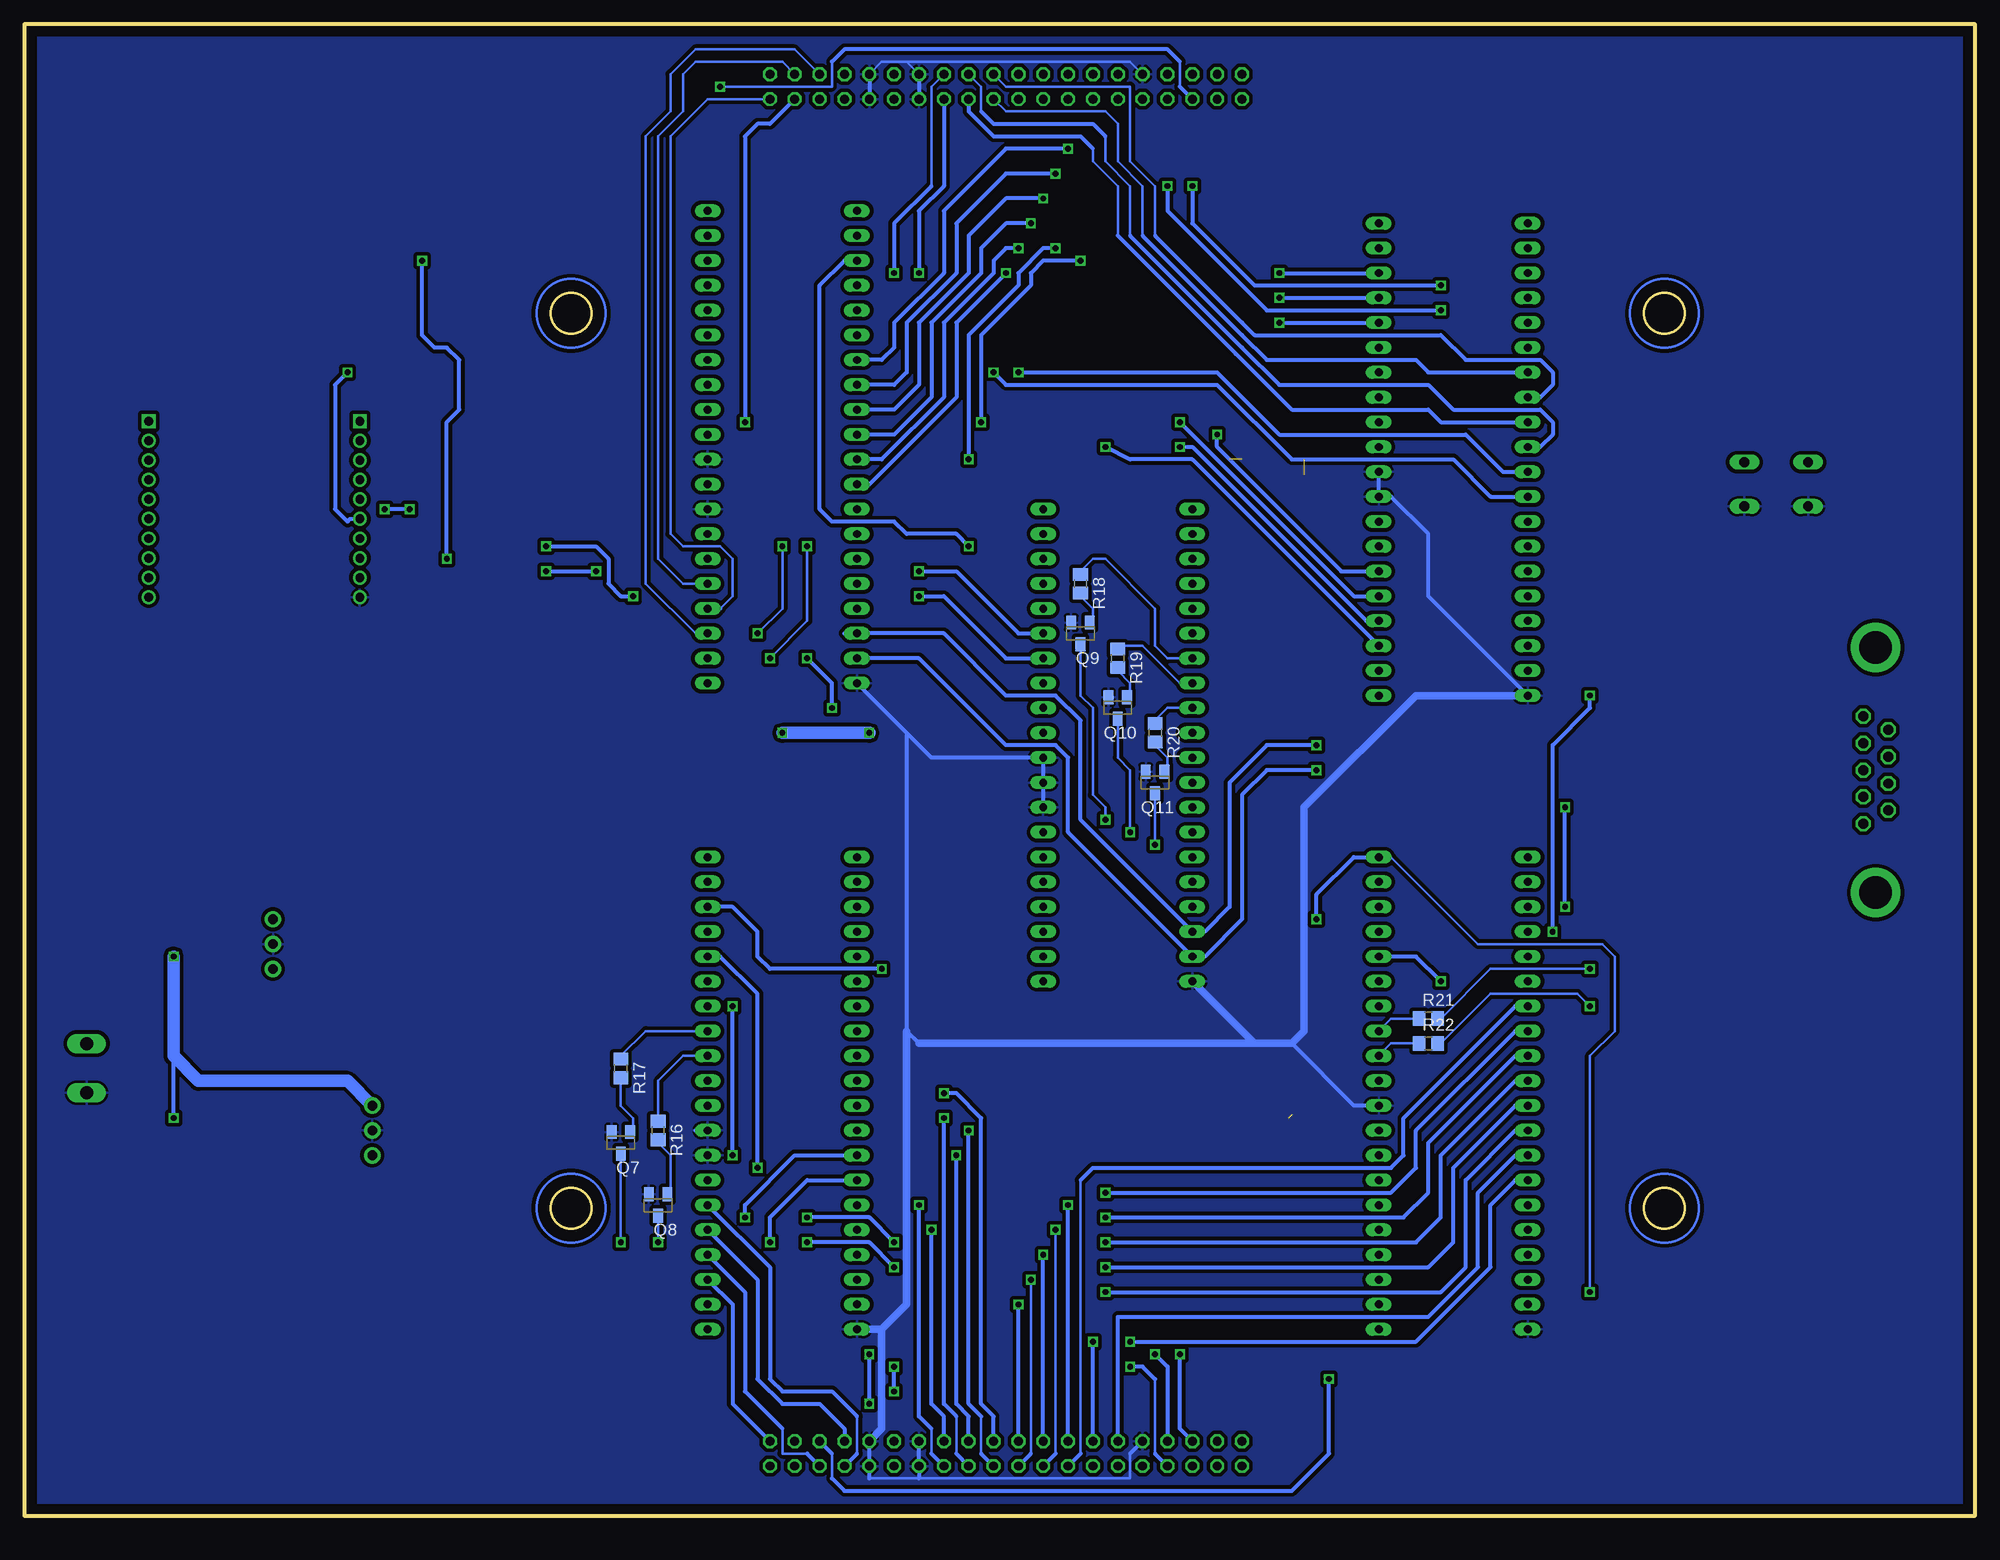
[diagram p7: board, bottom side, seen from below]

Size 199.39 x 152.4 mm. Coordinates in mm from the lower left corner, seen from the top.
Outline: 0,0 0,152.4 199.39,152.4 199.39,0 0,0
Outline: circle at 31.75,31.43 radius 2.06
Outline: circle at 143.51,31.43 radius 2.06
Outline: circle at 31.75,122.87 radius 2.06
Outline: circle at 143.51,122.87 radius 2.06
Copper layers (1*16): Top 0.035mm / dielectric 1.5mm / Bottom 0.035mm
Design rules "default *": minimum track width 10mil, minimum drill 24mil, track to track 15mil, track to pad 15mil, pad to pad 15mil, via to via 15mil, smd to smd 8mil, copper to edge 40mil, drill to drill 8mil, minimum pad ring 10mil, minimum via ring 8mil, stop-mask expansion 4mil, vias tented up to drill 0mil, thermal gap 10mil

### Footprints (pad centres in the part's own frame; a part is rotated, then mirrored left to right if it is on the bottom)
SMC_E = smd 2.4 x 2.8: + -3.15,0; - 3.15,0
C0805K = smd 1.3 x 1.6: 1 -1,0; 2 1,0
C0805 = smd 1.3 x 1.5: 1 -0.95,0; 2 0.95,0
CT3528 = smd 2 x 2.2: + -1.5,0; - 1.5,0
ML40 = drill 0.914 octagon: 1 -24.13,-1.27; 2 -24.13,1.27; 3 -21.59,-1.27; 4 -21.59,1.27; 5 -19.05,-1.27; 6 -19.05,1.27; 7 -16.51,-1.27; 8 -16.51,1.27; 9 -13.97,-1.27; 10 -13.97,1.27; 11 -11.43,-1.27; 12 -11.43,1.27; 13 -8.89,-1.27; 14 -8.89,1.27; 15 -6.35,-1.27; 16 -6.35,1.27; 17 -3.81,-1.27; 18 -3.81,1.27; 19 -1.27,-1.27; 20 -1.27,1.27; 21 1.27,-1.27; 22 1.27,1.27; 23 3.81,-1.27; 24 3.81,1.27; 25 6.35,-1.27; 26 6.35,1.27; 27 8.89,-1.27; 28 8.89,1.27; 29 11.43,-1.27; 30 11.43,1.27; 31 13.97,-1.27; 32 13.97,1.27; 33 16.51,-1.27; 34 16.51,1.27; 35 19.05,-1.27; 36 19.05,1.27; 37 21.59,-1.27; 38 21.59,1.27; 39 24.13,-1.27; 40 24.13,1.27
SIP3 = drill 1 pad 1.676: 1 -2.54,0; 2 0,0; 3 2.54,0
DIL40 = drill 0.813 long: 1 -24.13,-7.62; 2 -21.59,-7.62; 3 -19.05,-7.62; 4 -16.51,-7.62; 5 -13.97,-7.62; 6 -11.43,-7.62; 7 -8.89,-7.62; 8 -6.35,-7.62; 9 -3.81,-7.62; 10 -1.27,-7.62; 11 1.27,-7.62; 12 3.81,-7.62; 13 6.35,-7.62; 14 8.89,-7.62; 15 11.43,-7.62; 16 13.97,-7.62; 17 16.51,-7.62; 18 19.05,-7.62; 19 21.59,-7.62; 20 24.13,-7.62; 21 24.13,7.62; 22 21.59,7.62; 23 19.05,7.62; 24 16.51,7.62; 25 13.97,7.62; 26 11.43,7.62; 27 8.89,7.62; 28 6.35,7.62; 29 3.81,7.62; 30 1.27,7.62; 31 -1.27,7.62; 32 -3.81,7.62; 33 -6.35,7.62; 34 -8.89,7.62; 35 -11.43,7.62; 36 -13.97,7.62; 37 -16.51,7.62; 38 -19.05,7.62; 39 -21.59,7.62; 40 -24.13,7.62
1X10M = drill 0.914 square: 1 -9,0 | drill 0.914: 2 -7,0; 3 -5,0; 4 -3,0; 5 -1,0; 6 1,0; 7 3,0; 8 5,0; 9 7,0; 10 9,0
PLCC2 = smd 2.6 x 1.5: A 0,1.7; C 0,-1.7
SOT23 = smd 1 x 1.4: 1 -0.95,-1.1; 2 0.95,-1.1; 3 0,1.1
M0805 = smd 1.3 x 1.6: 1 -0.95,0; 2 0.95,0
R0805 = smd 1.3 x 1.5: 1 -0.95,0; 2 0.95,0
B3F-10XX = drill 1.016 long: 1 -3.251,2.261; 2 3.251,2.261; 3 -3.251,-2.261; 4 3.251,-2.261
AK300/2 = drill 1.321 long: 1 -2.515,0; 2 2.489,0
F09HP = drill 1.016 octagon: 1 -5.486,-1.27; 2 -2.743,-1.27; 3 0,-1.27; 4 2.743,-1.27; 5 5.486,-1.27; 6 -4.115,1.27; 7 -1.372,1.27; 8 1.372,1.27; 9 4.115,1.27 | drill 3.302 pad 5.08: G1 -12.522,0; G2 12.522,0

### Placement (x,y rotation side)
C1  177.8,40.64 180 top
C2  180.34,53.34 90 top
C3  12.7,105.41 270 top
C6  160.02,110.49 270 top
C7  158.75,115.57 0 top
CONECTOR_FRONT1  99.06,146.05 0 top
CONNECTOR_REAR1  99.06,6.35 0 top
DC1  173.99,58.42 90 top
DC2  163.83,39.37 90 top
FL_CHIP  53.34,107.95 270 top
FR_CHIP  121.92,109.22 270 top
JP1  165.1,102.87 270 top
JP2  186.69,102.87 270 top
LED1  162.56,130.81 90 top
LED2  160.02,21.59 0 top
LED3  176.53,21.59 0 top
LED4  34.29,106.68 180 top
LED5  135.89,87.63 180 top
LED6  140.97,87.63 180 top
LED7  39.37,106.68 180 top
LED8  88.9,46.99 180 top
LED9  83.82,46.99 180 top
LED10  78.74,46.99 180 top
LED11  140.97,22.86 180 top
LED12  135.89,22.86 180 top
LED13  34.29,39.37 180 top
LED14  39.37,39.37 180 top
MAIN_CHIP  87.63,78.74 270 top
Q1  53.34,104.14 180 top
Q2  57.15,99.06 180 top
Q3  34.29,50.8 180 top
Q4  38.1,46.99 180 top
Q5  119.38,113.03 180 top
Q6  121.92,107.95 180 top
Q7  138.43,38.1 180 bottom
Q8  134.62,31.75 180 bottom
Q9  91.44,90.17 180 bottom
Q10  87.63,82.55 180 bottom
Q11  83.82,74.93 180 bottom
R1  148.59,101.6 90 top
R2  181.61,116.84 270 top
R3  156.21,101.6 270 top
R4  152.4,101.6 90 top
R5  156.21,95.25 90 top
R6  68.58,105.41 90 top
R7  138.43,109.22 90 top
R8  69.85,41.91 270 top
R9  69.85,35.56 90 top
R10  138.43,45.72 90 top
R11  176.53,15.24 180 top
R12  160.02,15.24 0 top
R13  76.2,58.42 270 top
R14  120.65,119.38 270 top
R15  124.46,115.57 270 top
R16  134.62,39.37 270 bottom
R17  138.43,45.72 270 bottom
R18  91.44,95.25 270 bottom
R19  87.63,87.63 270 bottom
R20  83.82,80.01 270 bottom
R21  55.88,50.8 0 bottom
R22  55.88,48.26 0 bottom
R23  57.15,105.41 270 top
R24  53.34,110.49 270 top
R25  135.89,82.55 270 top
R26  140.97,82.55 270 top
R27  85.09,40.64 270 top
R28  81.28,40.64 270 top
R29  77.47,40.64 270 top
R30  146.05,11.43 0 top
R31  146.05,16.51 0 top
R32  39.37,26.67 270 top
R33  36.83,26.67 270 top
R34  35.56,92.71 270 top
R35  40.64,92.71 270 top
RL_CHIP  53.34,43.18 270 top
RR_CHIP  121.92,43.18 270 top
S1  20.32,105.41 0 top
X3  193.04,45.72 270 top
X4  10.16,76.2 90 top

### Tracks (layer width: path | path; a pad name or v marks a point on that pad's centre or on a via)
CAN_H  (via drill 0.6)
  Top 0.254: 8.99,74.93 17.78,74.93 | R13.2 76.52,57.15 MAIN_CHIP.19
  Top 0.406: v67.31,76.2 55.88,76.2 FL_CHIP.19 44.45,86.36 41.91,83.82 v41.91,72.39 | v41.91,62.23 41.91,25.4 RL_CHIP.19 46.99,21.59 48.26,20.32 48.26,17.78 44.45,13.97 30.48,13.97 24.13,20.32 24.13,68.58 17.78,74.93 | RR_CHIP.19 118.11,25.4 118.11,85.09 115.57,87.63 FR_CHIP.19 | X4.7 8.99,74.93
  Bottom 0.406: v67.31,76.2 72.39,76.2 74.93,73.66 74.93,60.96 78.74,57.15 MAIN_CHIP.19 92.71,69.85 92.71,77.47 93.98,78.74 99.06,78.74 107.95,87.63 FR_CHIP.19 | v41.91,62.23 v41.91,72.39
CAN_L  (via drill 0.6)
  Top 0.254: 11.63,73.66 17.78,73.66 | R13.1 76.52,59.69 MAIN_CHIP.18
  Top 0.406: v67.31,78.74 57.15,78.74 46.99,88.9 FL_CHIP.18 44.45,88.9 v39.37,83.82 | v43.18,59.69 43.18,26.67 RL_CHIP.18 46.99,24.13 49.53,21.59 49.53,17.78 44.45,12.7 30.48,12.7 22.86,20.32 22.86,68.58 17.78,73.66 | RR_CHIP.18 116.84,26.67 v116.84,82.55 | v119.38,87.63 119.38,88.9 118.11,90.17 FR_CHIP.18 | X4.2 11.63,73.66
  Bottom 0.406: v67.31,78.74 72.39,78.74 76.2,74.93 76.2,62.23 78.74,59.69 MAIN_CHIP.18 91.44,71.12 91.44,81.28 93.98,83.82 99.06,83.82 105.41,90.17 FR_CHIP.18 115.57,90.17 | v116.84,82.55 116.84,85.09 v119.38,87.63 | v43.18,59.69 43.18,78.74 39.37,82.55 v39.37,83.82
FL_AI0  (via drill 0.6)
  Top 0.406: CONECTOR_FRONT1.33 115.57,138.43 114.3,137.16 113.03,137.16 86.36,110.49 v77.47,110.49
  Bottom 0.406: FL_CHIP.26 64.77,96.52 77.47,109.22 v77.47,110.49
FL_AI1  (via drill 0.6)
  Top 0.254: 114.3,146.05 114.3,139.7
  Top 0.406: CONECTOR_FRONT1.34 114.3,146.05 | 114.3,139.7 86.36,111.76 v81.28,111.76
  Bottom 0.406: v81.28,111.76 63.5,93.98 FL_CHIP.25
FL_AI2  (via drill 0.6)
  Top 0.406: CONECTOR_FRONT1.35 118.11,139.7 114.3,135.89 113.03,135.89 86.36,109.22 v81.28,109.22
  Bottom 0.406: v81.28,109.22 80.01,109.22 62.23,91.44 FL_CHIP.24
FL_AI3  (via drill 0.6)
  Top 0.254: 121.92,146.05 121.92,142.24
  Top 0.406: CONECTOR_FRONT1.40 121.92,146.05 | 121.92,142.24 114.3,134.62 113.03,134.62 88.9,110.49 v88.9,109.22
  Bottom 0.406: FL_CHIP.23 80.01,107.95 86.36,107.95 v88.9,109.22
FL_DI0  (via drill 0.6)
  Top 0.406: CONECTOR_FRONT1.11 87.63,143.51 86.36,142.24 85.09,142.24 80.01,137.16 v80.01,135.89 | v54.61,125.73 53.34,125.73 49.53,121.92 49.53,104.14 46.99,101.6 FL_CHIP.13
  Bottom 0.406: v80.01,135.89 80.01,132.08 73.66,125.73 v54.61,125.73
FL_DI1  (via drill 0.6)
  Top 0.406: CONECTOR_FRONT1.13 90.17,140.97 88.9,139.7 85.09,139.7 82.55,137.16 v82.55,135.89 | v54.61,123.19 53.34,123.19 50.8,120.65 50.8,102.87 46.99,99.06 FL_CHIP.14
  Bottom 0.406: v82.55,135.89 82.55,133.35 72.39,123.19 v54.61,123.19
FL_DO0  (via drill 0.6)
  Top 0.254: 78.74,146.05 78.74,139.7
  Top 0.406: CONECTOR_FRONT1.6 78.74,146.05 | 78.74,139.7 76.2,137.16 76.2,128.27 74.93,127 v71.12,127
  Bottom 0.406: v71.12,127 FL_CHIP.38
FL_DO1  (via drill 0.6)
  Top 0.406: CONECTOR_FRONT1.7 82.55,142.24 77.47,137.16 77.47,125.73 76.2,124.46 v71.12,124.46
  Bottom 0.406: v71.12,124.46 FL_CHIP.37
FL_DO2  (via drill 0.6)
  Top 0.254: 83.82,146.05 83.82,142.24
  Top 0.406: CONECTOR_FRONT1.8 83.82,146.05 | 83.82,142.24 78.74,137.16 78.74,124.46 76.2,121.92 v71.12,121.92
  Bottom 0.406: v71.12,121.92 FL_CHIP.36
FL_LED1
  Top 0.254: FL_CHIP.33 55.88,114.3 53.34,111.76 R24.1
FL_LED2
  Top 0.254: FL_CHIP.32 59.69,111.76 57.15,109.22 R23.1
FL_PWM0
  Bottom 0.254: CONECTOR_FRONT1.21 99.06,143.51 88.9,143.51 87.63,142.24 87.63,138.43 85.09,135.89 85.09,130.81
  Bottom 0.406: FL_CHIP.7 55.88,116.84 57.15,118.11 72.39,118.11 74.93,120.65 85.09,130.81
FL_PWM1
  Bottom 0.254: CONECTOR_FRONT1.22 99.06,146.05 86.36,146.05 86.36,138.43 83.82,135.89 83.82,130.81
  Bottom 0.406: FL_CHIP.8 44.45,114.3 43.18,115.57 43.18,116.84 44.45,118.11 52.07,118.11 54.61,120.65 73.66,120.65 74.93,121.92 83.82,130.81
FL_PWM2
  Bottom 0.254: 90.17,139.7 90.17,138.43 87.63,135.89 87.63,130.81
  Bottom 0.406: CONECTOR_FRONT1.23 102.87,143.51 100.33,140.97 91.44,140.97 90.17,139.7 | FL_CHIP.9 54.61,111.76 55.88,113.03 69.85,113.03 75.56,118.74 87.63,130.81
FL_PWM3
  Bottom 0.254: CONECTOR_FRONT1.24 101.6,146.05 101.6,143.51 | 88.9,140.97 88.9,138.43 86.36,135.89 86.36,130.81
  Bottom 0.406: 101.6,143.51 100.33,142.24 90.17,142.24 88.9,140.97 | FL_CHIP.10 44.45,109.22 43.18,110.49 43.18,111.76 44.45,113.03 53.34,113.03 55.88,115.57 71.12,115.57 74.93,119.38 86.36,130.81
FL_PWM4  (via drill 0.6)
  Top 0.406: v107.95,127 v97.79,116.84
  Bottom 0.406: CONECTOR_FRONT1.25 105.41,135.89 107.95,133.35 v107.95,127 | v97.79,116.84 77.47,116.84 71.12,110.49 52.07,110.49 48.26,106.68 FL_CHIP.11
FL_PWM5  (via drill 0.6)
  Top 0.406: v110.49,127 v100.33,116.84
  Bottom 0.254: CONECTOR_FRONT1.26 106.68,146.05 106.68,135.89
  Bottom 0.406: 106.68,135.89 110.49,132.08 v110.49,127 | v100.33,116.84 99.06,115.57 77.47,115.57 69.85,107.95 53.34,107.95 49.53,104.14 FL_CHIP.12
FR_AI0  (via drill 0.6)
  Top 0.406: v125.73,111.76 125.73,100.33 128.27,97.79 FR_CHIP.26
  Bottom 0.406: CONECTOR_FRONT1.37 123.19,142.24 124.46,142.24 125.73,140.97 v125.73,111.76
FR_AI1
  Bottom 0.254: CONECTOR_FRONT1.38 121.92,148.59 130.81,148.59 132.08,147.32 132.08,143.51 134.62,140.97 134.62,97.79 132.08,95.25 FR_CHIP.25
FR_AI2
  Bottom 0.254: 128.27,92.71 127,93.98 127,97.79 128.27,99.06 132.08,99.06 133.35,100.33 133.35,140.97 129.54,144.78 CONECTOR_FRONT1.39
  Bottom 0.406: 128.27,92.71 FR_CHIP.24
FR_AI3
  Bottom 0.254: CONECTOR_FRONT1.36 120.65,149.86 130.81,149.86 133.35,147.32 133.35,143.51 135.89,140.97 135.89,95.25 130.81,90.17 FR_CHIP.23
FR_DI0  (via drill 0.6)
  Top 0.254: 88.9,146.05 88.9,142.24
  Top 0.406: CONECTOR_FRONT1.12 88.9,146.05 | 88.9,142.24 87.63,140.97 85.09,140.97 81.28,137.16 81.28,134.62 87.63,128.27 v91.44,128.27 | v101.6,111.76 102.87,110.49 104.14,110.49 111.76,102.87 FR_CHIP.13
  Bottom 0.406: v91.44,128.27 95.25,128.27 96.52,127 96.52,125.73 101.6,120.65 v101.6,111.76
FR_DI1  (via drill 0.6)
  Top 0.254: 91.44,146.05 91.44,140.97
  Top 0.406: CONECTOR_FRONT1.14 91.44,146.05 | 91.44,140.97 88.9,138.43 85.09,138.43 83.82,137.16 83.82,133.35 87.63,129.54 v93.98,129.54 | v102.87,107.95 110.49,100.33 FR_CHIP.14
  Bottom 0.406: v93.98,129.54 95.25,129.54 97.79,127 97.79,125.73 102.87,120.65 v102.87,107.95
FR_DIP2
  Top 0.406: R7.1 135.57,105.41 FR_CHIP.29
FR_DO0
  Top 0.254: 76.2,148.59 76.2,146.05
  Top 0.406: FR_CHIP.38 127,128.27 125.73,129.54 125.73,135.89 133.35,143.51 133.35,148.59 132.08,149.86 77.47,149.86 76.2,148.59 | 76.2,146.05 CONECTOR_FRONT1.3
FR_DO1
  Top 0.254: 130.81,148.59 78.74,148.59
  Top 0.406: FR_CHIP.37 127,125.73 124.46,128.27 124.46,135.89 132.08,143.51 132.08,147.32 130.81,148.59 | 78.74,148.59 CONECTOR_FRONT1.4
FR_DO2  (via drill 0.6)
  Top 0.406: FR_CHIP.36 128.27,123.19 123.19,128.27 123.19,135.89 130.81,143.51 130.81,144.78 129.54,146.05 v128.27,146.05
  Bottom 0.254: 116.84,146.05 116.84,148.59 | 81.28,148.59 81.28,146.05
  Bottom 0.279: v128.27,146.05 116.84,146.05
  Bottom 0.406: 81.28,146.05 CONECTOR_FRONT1.5 | 81.28,148.59 82.55,149.86 115.57,149.86 116.84,148.59
FR_LED1
  Top 0.254: FR_CHIP.33 124.46,120.65 120.97,120.65 R14.1
FR_LED2
  Top 0.254: FR_CHIP.32 125.73,116.84 124.78,116.84 R15.1
FR_PWM0  (via drill 0.6)
  Top 0.406: CONECTOR_FRONT1.15 v92.71,139.7
  Bottom 0.406: v92.71,139.7 99.06,139.7 105.41,133.35 105.41,127 110.49,121.92 110.49,119.38 111.76,118.11 FR_CHIP.7
FR_PWM1  (via drill 0.6)
  Top 0.254: 93.98,146.05 v93.98,137.16
  Top 0.406: CONECTOR_FRONT1.16 93.98,146.05
  Bottom 0.406: v93.98,137.16 99.06,137.16 104.14,132.08 104.14,127 109.22,121.92 109.22,116.84 110.49,115.57 FR_CHIP.8
FR_PWM2  (via drill 0.6)
  Top 0.406: CONECTOR_FRONT1.17 v95.25,134.62
  Bottom 0.406: v95.25,134.62 99.06,134.62 102.87,130.81 102.87,127 107.95,121.92 107.95,115.57 110.49,113.03 FR_CHIP.9
FR_PWM3  (via drill 0.6)
  Top 0.254: 96.52,146.05 v96.52,132.08
  Top 0.406: CONECTOR_FRONT1.18 96.52,146.05
  Bottom 0.406: v96.52,132.08 99.06,132.08 101.6,129.54 101.6,127 106.68,121.92 106.68,114.3 110.49,110.49 FR_CHIP.10
FR_PWM4  (via drill 0.6)
  Top 0.406: CONECTOR_FRONT1.19 v97.79,129.54
  Bottom 0.406: v97.79,129.54 99.06,129.54 100.33,128.27 100.33,127 105.41,121.92 105.41,114.3 111.76,107.95 FR_CHIP.11
FR_PWM5  (via drill 0.6)
  Top 0.254: 99.06,146.05 v99.06,127
  Top 0.406: CONECTOR_FRONT1.20 99.06,146.05
  Bottom 0.406: v99.06,127 104.14,121.92 104.14,114.3 113.03,105.41 FR_CHIP.12
GND
  Top 0.254: RR_CHIP.28 121.92,29.21 121.92,24.13
  Top 0.406: 157.16,94.3 R5.1 | S1.4 S1.3
  Top 0.762: RR_CHIP.29 RR_CHIP.28 | 121.92,24.13 116.84,19.05 RR_CHIP.20
  Bottom 0.254: CONECTOR_FRONT1.28 109.22,148.59 | 109.22,148.59 111.76,148.59 CONECTOR_FRONT1.32 | CONECTOR_FRONT1.10 86.36,148.59 109.22,148.59 | 113.03,3.81 107.95,3.81 86.36,3.81 86.36,6.35
  Bottom 0.406: FR_CHIP.20 109.22,80.01 | 109.22,80.01 109.22,49.53 107.95,48.26 | RL_CHIP.30 63.5,41.91 69.85,48.26 | 109.22,80.01 106.68,77.47 MAIN_CHIP.30 MAIN_CHIP.29 MAIN_CHIP.28 | FL_CHIP.20 55.88,93.98 55.88,100.33 59.69,104.14 FL_CHIP.29 FL_CHIP.30 | CONECTOR_FRONT1.32 CONECTOR_FRONT1.31 | CONECTOR_FRONT1.28 CONECTOR_FRONT1.27 | CONNECTOR_REAR1.32 CONNECTOR_REAR1.31 113.03,3.81 | 107.95,3.81 CONNECTOR_REAR1.27 CONNECTOR_REAR1.28 | CONNECTOR_REAR1.10 86.36,6.35 | RR_CHIP.29 130.81,39.37
  Bottom 0.762: 109.22,49.53 109.22,21.59 111.76,19.05 | 111.76,19.05 RR_CHIP.20 | 73.66,48.26 69.85,48.26 68.58,49.53 68.58,72.39 57.15,83.82 FL_CHIP.20 | MAIN_CHIP.20 73.66,48.26 | 73.66,48.26 107.95,48.26 | CONNECTOR_REAR1.32 111.76,8.89 111.76,19.05
  pour Top: 1.27,151.13 198.12,151.13 198.12,1.27 1.27,1.27
  pour Bottom: 1.27,151.13 1.27,1.27 198.12,1.27 198.12,151.13
LED  (via drill 0.6)
  Top 0.406: LED1.C 166.37,128.7 v166.37,116.84
  Bottom 0.406: v166.37,116.84 167.64,115.57 167.64,102.87 166.37,101.6 166.1,101.87 JP1.6
MAIN_LED1
  Bottom 0.254: MAIN_CHIP.7 82.55,87.63 83.82,88.9 83.82,92.71 88.9,97.79 90.17,97.79 91.44,96.52 R18.1
MAIN_LED2
  Bottom 0.254: MAIN_CHIP.8 81.28,85.09 85.09,88.9 87.31,88.9 R19.1
MAIN_LED3
  Bottom 0.254: MAIN_CHIP.9 82.55,82.55 83.82,81.28 R20.1
N$1  (via drill 0.6)
  Top 0.406: R5.2 v156.21,97.79 | v158.75,128.27 160.86,130.38 LED1.A
  Bottom 0.406: v156.21,97.79 156.21,111.76 154.94,113.03 154.94,118.11 156.21,119.38 157.48,119.38 158.75,120.65 v158.75,128.27
N$2
  Top 0.406: LED3.C 177.8,18.62 177.8,15.24 R11.1
N$3
  Top 0.406: FL_CHIP.28 66.04,101.6 68.58,104.14 R6.1
N$4
  Top 0.406: LED2.C 157.48,17.35 157.48,16.51 158.75,15.24 R12.1
N$5
  Top 0.254: R14.2 120.65,114.45 Q5.1
N$6
  Top 0.254: R15.2 124.46,114.3 123.19,113.03 123.19,109.37 Q6.1
N$7
  Bottom 0.254: R16.2 134.62,38.1 133.35,36.83 133.35,33.17 Q8.1
N$8
  Bottom 0.254: R17.2 138.43,41.91 137.16,40.64 137.16,39.52 Q7.1
N$9  (via drill 0.6)
  Top 0.254: v39.37,55.88 38.1,55.88 35.56,53.34 35.56,52.22 Q3.1
  Bottom 0.254: R21.2 54.61,50.8 49.53,55.88 v39.37,55.88
N$10  (via drill 0.6)
  Top 0.254: v39.37,52.07 39.37,48.41 Q4.1
  Bottom 0.254: R22.2 54.61,48.26 49.53,53.34 40.64,53.34 v39.37,52.07
N$11
  Top 0.254: R24.2 53.34,107.95 54.61,106.68 54.61,105.56 Q1.1
N$12
  Top 0.254: R23.2 57.15,102.87 58.42,101.6 58.42,100.48 Q2.1
N$13
  Top 0.254: Q1.3 53.34,100.33 50.8,97.79 44.45,97.79 43.18,99.06 43.18,110.49 41.91,111.76 36.83,111.76 34.29,109.22 LED4.C
N$14  (via drill 0.6)
  Top 0.254: Q5.3 v119.38,99.06 | v123.19,87.63 124.46,86.36 130.81,86.36 133.35,88.9 135.46,88.9 LED5.C
  Bottom 0.254: v119.38,99.06 119.38,91.44 v123.19,87.63
N$15  (via drill 0.6)
  Top 0.254: v88.9,71.12 LED8.C
  Bottom 0.254: Q9.3 91.44,83.82 90.17,82.55 90.17,73.66 88.9,72.39 v88.9,71.12
N$16  (via drill 0.6)
  Top 0.254: v83.82,68.58 83.82,53.34 82.55,52.07 81.28,52.07 77.47,48.26 78.31,48.26 LED10.C
  Bottom 0.254: Q11.3 v83.82,68.58
N$17  (via drill 0.6)
  Top 0.254: v138.43,27.94 140.97,25.4 LED11.C
  Bottom 0.254: Q7.3 v138.43,27.94
N$18
  Top 0.254: Q3.3 LED13.C
N$19
  Top 0.254: Q2.3 57.15,97.79 54.61,95.25 44.45,95.25 41.91,97.79 41.91,106.68 40.64,107.95 39.8,107.95 LED7.C
N$20
  Top 0.254: Q4.3 38.1,44.45 39.37,43.18 LED14.C
N$21  (via drill 0.6)
  Top 0.254: Q6.3 v121.92,99.06 | v124.46,90.17 125.73,88.9 130.81,88.9 133.35,91.44 138.86,91.44 LED6.C
  Bottom 0.254: v121.92,99.06 121.92,92.71 v124.46,90.17
N$22  (via drill 0.6)
  Top 0.254: v134.62,27.94 135.89,26.67 LED12.C
  Bottom 0.254: Q8.3 v134.62,27.94
N$23  (via drill 0.6)
  Top 0.254: LED9.C 83.82,49.53 86.36,52.07 v86.36,69.85
  Bottom 0.254: Q10.3 87.63,77.47 86.36,76.2 v86.36,69.85
N$24
  Top 0.254: LED5.A R25.1
N$25
  Top 0.254: LED6.A R26.1
N$26
  Top 0.254: LED8.A 88.9,43.18 87.63,41.91 85.41,41.91 R27.1
N$27
  Top 0.254: LED9.A 83.82,44.13 R28.1
N$28
  Top 0.254: LED10.A 78.74,42.86 R29.1
N$29
  Top 0.254: LED12.A 135.89,20.64 R30.1
N$30
  Top 0.254: LED11.A 140.97,20.64 R31.1
N$31
  Top 0.254: LED14.A R32.1
N$32
  Top 0.254: LED13.A 34.72,37.67 36.83,35.56 R33.1
N$33
  Top 0.254: LED4.A 34.29,96.52 35.56,95.25 R34.1
N$34
  Top 0.254: LED7.A 39.37,96.52 40.64,95.25 R35.1
N$35
  Bottom 0.254: R18.2 91.44,93.98 90.17,92.71 90.17,91.59 Q9.1
N$36
  Bottom 0.254: R19.2 87.63,86.36 86.36,85.09 86.36,83.97 Q10.1
N$38
  Bottom 0.254: R20.2 83.82,78.74 82.55,77.47 82.55,76.35 Q11.1
RESET  (via drill 0.6)
  Top 0.254: C3.1 13.96,107.67 S1.1
  Top 0.406: S1.1 S1.2 30.98,115.08 | 30.98,115.08 42.9,127 FL_CHIP.3 | 30.98,115.08 30.98,76.97 RL_CHIP.3 46.99,62.23 48.26,63.5 66.04,63.5 73.66,71.12 83.82,71.12 90.17,77.47 | RR_CHIP.3 105.41,62.23 101.6,66.04 101.6,68.58 99.06,71.12 92.71,71.12 90.17,73.66 90.17,77.47 | 90.17,77.47 90.17,87.63 MAIN_CHIP.3 81.28,96.52 100.33,96.52 v102.87,99.06
  Bottom 0.406: v102.87,99.06 104.14,100.33 109.22,100.33 110.49,101.6 116.84,101.6 118.11,102.87 118.11,125.73 115.57,128.27 FR_CHIP.3
RL_AI0  (via drill 0.6)
  Top 0.254: 119.38,6.35 119.38,8.89
  Top 0.406: CONNECTOR_REAR1.37 119.38,6.35 | 119.38,8.89 116.84,11.43 v113.03,11.43 | RL_CHIP.26 64.77,31.75 71.12,25.4 71.12,15.24 72.39,13.97 102.87,13.97 105.41,16.51 v113.03,16.51
  Bottom 0.406: v113.03,11.43 v113.03,16.51
RL_AI1  (via drill 0.6)
  Top 0.406: CONNECTOR_REAR1.38 120.65,8.89 116.84,12.7 v110.49,12.7 | RL_CHIP.25 64.77,29.21 69.85,24.13 69.85,13.97 71.12,12.7 104.14,12.7 106.68,15.24 v110.49,15.24
  Bottom 0.406: v110.49,12.7 v110.49,15.24
RL_AI2
  Top 0.254: 121.92,6.35 121.92,8.89
  Top 0.406: CONNECTOR_REAR1.39 121.92,6.35 | 121.92,8.89 116.84,13.97 107.95,13.97 105.41,11.43 69.85,11.43 68.58,12.7 68.58,22.86 64.77,26.67 RL_CHIP.24
RL_AI3  (via drill 0.6)
  Top 0.406: v66.04,13.97 66.04,21.59 63.5,24.13 RL_CHIP.23
  Bottom 0.254: 116.84,6.35 116.84,3.81
  Bottom 0.406: CONNECTOR_REAR1.36 116.84,6.35 | 116.84,3.81 115.57,2.54 69.85,2.54 66.04,6.35 v66.04,13.97
RL_DI0
  Bottom 0.406: CONNECTOR_REAR1.12 87.63,20.32 55.88,20.32 50.8,25.4 50.8,33.02 46.99,36.83 RL_CHIP.13
RL_DI1  (via drill 0.6)
  Top 0.406: v90.17,17.78 v86.36,17.78
  Bottom 0.406: CONNECTOR_REAR1.14 v90.17,17.78 | v86.36,17.78 57.15,17.78 49.53,25.4 49.53,31.75 46.99,34.29 RL_CHIP.14
RL_DIP2
  Top 0.406: 69.85,43.18 R8.1 66.99,42.86 63.5,39.37 RL_CHIP.29
RL_DIP3
  Top 0.406: R9.1 69.53,34.29 66.04,34.29 63.5,36.83 RL_CHIP.28
RL_DO0
  Top 0.254: 76.2,3.81 59.69,3.81
  Top 0.406: CONNECTOR_REAR1.3 76.2,3.81 | 59.69,3.81 55.88,7.62 55.88,57.15 RL_CHIP.38
RL_DO1
  Top 0.254: 76.2,6.35 60.96,6.35
  Top 0.406: CONNECTOR_REAR1.4 76.2,6.35 | 60.96,6.35 57.15,10.16 57.15,57.15 59.69,59.69 RL_CHIP.37
RL_DO2  (via drill 0.6)
  Top 0.406: CONNECTOR_REAR1.5 77.47,2.54 58.42,2.54 54.61,6.35 v54.61,54.61
  Bottom 0.406: v54.61,54.61 57.15,57.15 RL_CHIP.36
RL_LED1
  Bottom 0.254: RL_CHIP.33 59.69,50.8 R21.1
RL_LED2
  Bottom 0.254: RL_CHIP.32 59.69,48.26 R22.1
RL_PWM0
  Bottom 0.254: 91.44,6.35 91.44,34.29
  Bottom 0.406: CONNECTOR_REAR1.15 91.44,6.35 | 91.44,34.29 90.17,35.56 59.69,35.56 58.42,36.83 58.42,40.64 46.99,52.07 RL_CHIP.7
RL_PWM1  (via drill 0.6)
  Top 0.406: v92.71,31.75 91.44,33.02 v88.9,33.02
  Bottom 0.406: CONNECTOR_REAR1.16 v92.71,31.75 | v88.9,33.02 59.69,33.02 57.15,35.56 57.15,39.37 46.99,49.53 RL_CHIP.8
RL_PWM2  (via drill 0.6)
  Top 0.406: v93.98,29.21 92.71,30.48 v88.9,30.48
  Bottom 0.254: 93.98,6.35 v93.98,29.21
  Bottom 0.406: CONNECTOR_REAR1.17 93.98,6.35 | v88.9,30.48 58.42,30.48 55.88,33.02 55.88,38.1 46.99,46.99 RL_CHIP.9
RL_PWM3  (via drill 0.6)
  Top 0.406: v95.25,26.67 93.98,27.94 v88.9,27.94
  Bottom 0.406: CONNECTOR_REAR1.18 v95.25,26.67 | v88.9,27.94 57.15,27.94 54.61,30.48 54.61,36.83 46.99,44.45 RL_CHIP.10
RL_PWM4  (via drill 0.6)
  Top 0.406: v96.52,24.13 95.25,25.4 v88.9,25.4
  Bottom 0.254: 96.52,6.35 v96.52,24.13
  Bottom 0.406: CONNECTOR_REAR1.19 96.52,6.35 | v88.9,25.4 55.88,25.4 53.34,27.94 53.34,35.56 46.99,41.91 RL_CHIP.11
RL_PWM5  (via drill 0.6)
  Top 0.406: v97.79,21.59 96.52,22.86 v88.9,22.86
  Bottom 0.406: CONNECTOR_REAR1.20 v97.79,21.59 | v88.9,22.86 54.61,22.86 52.07,25.4 52.07,34.29 46.99,39.37 RL_CHIP.12
RR_AI0
  Bottom 0.254: 114.3,10.16 114.3,6.35
  Bottom 0.406: RR_CHIP.26 123.19,25.4 123.19,13.97 121.92,12.7 116.84,12.7 114.3,10.16 | 114.3,6.35 CONNECTOR_REAR1.33
RR_AI1
  Bottom 0.406: RR_CHIP.25 124.46,24.13 124.46,13.97 121.92,11.43 118.11,11.43 115.57,8.89 CONNECTOR_REAR1.34
RR_AI2
  Bottom 0.254: 121.92,8.89 121.92,6.35 119.38,6.35
  Bottom 0.406: RR_CHIP.24 125.73,22.86 125.73,12.7 121.92,8.89 | 119.38,6.35 CONNECTOR_REAR1.35
RR_AI3
  Bottom 0.406: RR_CHIP.23 127,21.59 127,11.43 CONNECTOR_REAR1.40
RR_DI0  (via drill 0.6)
  Top 0.406: CONNECTOR_REAR1.11 90.17,2.54 125.73,2.54 129.54,6.35 129.54,13.97 125.73,17.78 v125.73,30.48
  Bottom 0.406: RR_CHIP.13 120.65,36.83 125.73,31.75 v125.73,30.48
RR_DI1  (via drill 0.6)
  Top 0.254: 91.44,3.81 125.73,3.81
  Top 0.406: CONNECTOR_REAR1.13 91.44,3.81 | 125.73,3.81 128.27,6.35 128.27,13.97 124.46,17.78 124.46,26.67 v123.19,27.94
  Bottom 0.406: RR_CHIP.14 119.38,34.29 123.19,30.48 v123.19,27.94
RR_DIP1
  Top 0.406: RR_CHIP.30 138.43,41.91 R10.1
RR_DO0  (via drill 0.6)
  Top 0.406: v81.28,16.51 81.28,17.78 86.36,22.86 86.36,36.83 105.41,55.88 v111.76,55.88
  Bottom 0.406: CONNECTOR_REAR1.6 81.28,8.89 v81.28,16.51 | v111.76,55.88 123.19,55.88 124.46,57.15 124.46,59.69 127,62.23 RR_CHIP.38
RR_DO1  (via drill 0.6)
  Top 0.406: v86.36,15.24 100.33,15.24 v110.49,25.4 | v127,52.07 127,58.42 128.27,59.69 RR_CHIP.37 | v127,36.83 127,35.56 v119.38,27.94
  Bottom 0.254: 83.82,6.35 83.82,13.97
  Bottom 0.406: CONNECTOR_REAR1.7 83.82,6.35 | 83.82,13.97 85.09,15.24 v86.36,15.24 | v110.49,25.4 113.03,27.94 v119.38,27.94 | v127,36.83 v127,52.07
RR_DO2  (via drill 0.6)
  Top 0.406: v83.82,16.51 99.06,16.51 v110.49,27.94 | v124.46,35.56 v119.38,30.48
  Bottom 0.406: v110.49,27.94 113.03,30.48 v119.38,30.48 | v124.46,35.56 124.46,53.34 128.27,57.15 RR_CHIP.36 | v83.82,16.51 82.55,15.24 CONNECTOR_REAR1.8
RR_LED1
  Bottom 0.254: R17.1 138.43,46.99 135.89,49.53 RR_CHIP.33
RR_LED2
  Bottom 0.254: RR_CHIP.32 132.08,46.99 134.62,44.45 R16.1
RR_PWM0  (via drill 0.6)
  Top 0.406: v102.87,39.37 102.87,44.45 110.49,52.07 RR_CHIP.7
  Bottom 0.254: 101.6,6.35 101.6,10.16
  Bottom 0.406: CONNECTOR_REAR1.21 101.6,6.35 | 101.6,10.16 102.87,11.43 v102.87,39.37
RR_PWM1  (via drill 0.6)
  Top 0.406: v105.41,43.18 111.76,49.53 RR_CHIP.8
  Bottom 0.406: CONNECTOR_REAR1.22 100.33,10.16 101.6,11.43 101.6,40.64 104.14,43.18 v105.41,43.18
RR_PWM2  (via drill 0.6)
  Top 0.406: v105.41,40.64 111.76,46.99 RR_CHIP.9
  Bottom 0.254: 104.14,6.35 104.14,10.16
  Bottom 0.406: CONNECTOR_REAR1.23 104.14,6.35 | 104.14,10.16 105.41,11.43 v105.41,40.64
RR_PWM3  (via drill 0.6)
  Top 0.406: v104.14,36.83 104.14,38.1 105.41,39.37 106.68,39.37 111.76,44.45 RR_CHIP.10
  Bottom 0.406: CONNECTOR_REAR1.24 102.87,10.16 104.14,11.43 v104.14,36.83
RR_PWM4  (via drill 0.6)
  Top 0.406: v107.95,31.75 107.95,36.83 113.03,41.91 RR_CHIP.11
  Bottom 0.254: 106.68,6.35 106.68,8.89
  Bottom 0.406: CONNECTOR_REAR1.25 106.68,6.35 | 106.68,8.89 107.95,10.16 v107.95,31.75
RR_PWM5  (via drill 0.6)
  Top 0.406: v106.68,29.21 107.95,30.48 109.22,30.48 110.49,31.75 110.49,36.83 113.03,39.37 RR_CHIP.12
  Bottom 0.406: CONNECTOR_REAR1.26 105.41,10.16 106.68,11.43 v106.68,29.21
UART_RX  (via drill 0.6)
  Top 0.406: R1.1 147,99.06 v146.05,99.06 | v137.16,93.98 v107.95,93.98
  Bottom 0.406: v146.05,99.06 140.97,99.06 139.7,97.79 139.7,95.25 138.43,93.98 v137.16,93.98 | v107.95,93.98 105.41,93.98 99.06,87.63 MAIN_CHIP.34
UART_TX  (via drill 0.6)
  Top 0.406: R4.1 148.27,96.52 v146.05,96.52 | v140.97,96.52 v107.95,96.52
  Bottom 0.406: v146.05,96.52 v140.97,96.52 | v107.95,96.52 104.14,96.52 97.79,90.17 MAIN_CHIP.35
VBAT
  Top 1.27: X3.1 186.72,48.24 185.42,49.53 181,49.53 C2.+ | DC2.1 180.34,36.83 181.61,38.1 181.61,39.98 C1.+ 181.61,41.3 181.61,43.18 180.34,44.45 C2.+ | C2.+ 175.87,50.19 173.99,52.07 DC1.1
VCC  (via drill 0.6)  (3 unrouted)
  Top 0.254: R33.2 R32.2 v39.37,22.86 | R27.2 R28.2 R29.2 75.88,39.69 73.66,41.91 | R34.2 R35.2 42.23,91.76 43.18,92.71 54.61,92.71 59.69,97.79 66.04,97.79 76.2,107.95 | R30.2 R31.2 149.86,16.51 156.21,22.86 159.59,22.86 LED2.A
  Top 0.406: 138.43,46.99 R10.2 135.89,49.21 135.89,63.5 | 70.17,40.64 72.39,40.64 73.66,41.91 73.66,44.45 67.31,50.8 v67.31,60.96 | 138.43,110.49 R7.2 | LED2.A 161.29,24.56 161.29,57.15 162.56,58.42 | R9.2 R8.2
  Top 1.27: 97.79,107.95 100.33,107.95 105.41,102.87 105.41,81.28 106.68,80.01 v113.03,80.01 | RR_CHIP.40 132.08,67.31 135.89,63.5 143.51,71.12 | FR_CHIP.40 130.81,133.35 133.35,130.81 133.35,115.57 138.43,110.49 139.7,110.49 143.51,106.68 143.51,93.98 147.32,90.17 147.32,83.82 143.51,80.01 | FL_CHIP.40 63.5,132.08 68.58,127 68.58,107.95 76.2,107.95 78.74,107.95 80.01,106.68 91.44,106.68 92.71,107.95 97.79,107.95 | RL_CHIP.40 74.93,81.28 74.93,107.95 | MAIN_CHIP.40 96.52,104.14 96.52,106.68 97.79,107.95 | 143.51,71.12 143.51,62.23 147.32,58.42 162.56,58.42 168.91,58.42 171.45,60.96 DC1.3 | 143.51,71.12 143.51,80.01 | v121.92,80.01 130.81,80.01 132.4,81.6 R25.2 R26.2 142.56,80.01 143.51,80.01
  Bottom 0.254: v39.37,22.86 39.37,46.99 36.83,49.53 36.83,57.15 38.1,58.42 50.8,58.42 59.69,67.31 RL_CHIP.40
  Bottom 0.406: v67.31,60.96 67.31,63.5 63.5,67.31 RL_CHIP.40
  Bottom 1.27: v113.03,80.01 v121.92,80.01
VCC3V3  (via drill 0.6)
  Top 0.406: C7.+ 157.48,115.34 157.48,113.03 159.07,111.44 C6.1 160.02,111.76 164.99,111.76 JP1.1 | LED3.A 184.15,30.91 v184.15,40.64
  Top 1.27: v184.15,57.15 184.15,114.3 185.42,115.57 185.42,118.11 184.15,119.38 182.88,119.38 181.61,118.11 R2.1 171.02,117.79 JP1.1
  Bottom 0.406: v184.15,40.64 184.15,46.99
  Bottom 1.27: DC2.3 166.37,44.45 181.61,44.45 184.15,46.99 v184.15,57.15
XBEERESET
  Top 0.406: R2.2 181.61,109.22 176.53,104.14 165.37,104.14 JP1.5
XBEERX  (via drill 0.6)
  Top 0.406: R3.1 156.21,102.87 | 156.21,102.87 155.89,102.55 R4.2 | 156.21,102.87 v160.02,102.87 | v162.56,102.87 162.56,105.33 JP1.3
  Bottom 0.406: v160.02,102.87 v162.56,102.87
XBEETX
  Top 0.406: JP1.2 164.45,109.22 163.83,109.22 160.02,105.41 153.67,105.41 152.4,104.14 149.86,104.14 148.59,102.87 R1.2
(copper drawn outside any net)
  shapes: Bottom circle x4, Top circle x4

### Text on the board
Top: Front | Reset | CAN | VBAT+ | X-Mobile 2015 | VBAT- | Rear